# EasyEDA Pro project ProPrj_cheap-board-max-10_2026-05-07.epro, schematic Schematic1

## Sheets
1 PWR: Board Name: Board1; Create Date: 2026-03-08; Page Name: PWR; Project Name: cheap-board-max-10; Schematic Name: Schematic1; Update Date: 2026-04-17; Drawn: -; Page Size: A4; Reviewed: -; Version: V1.0
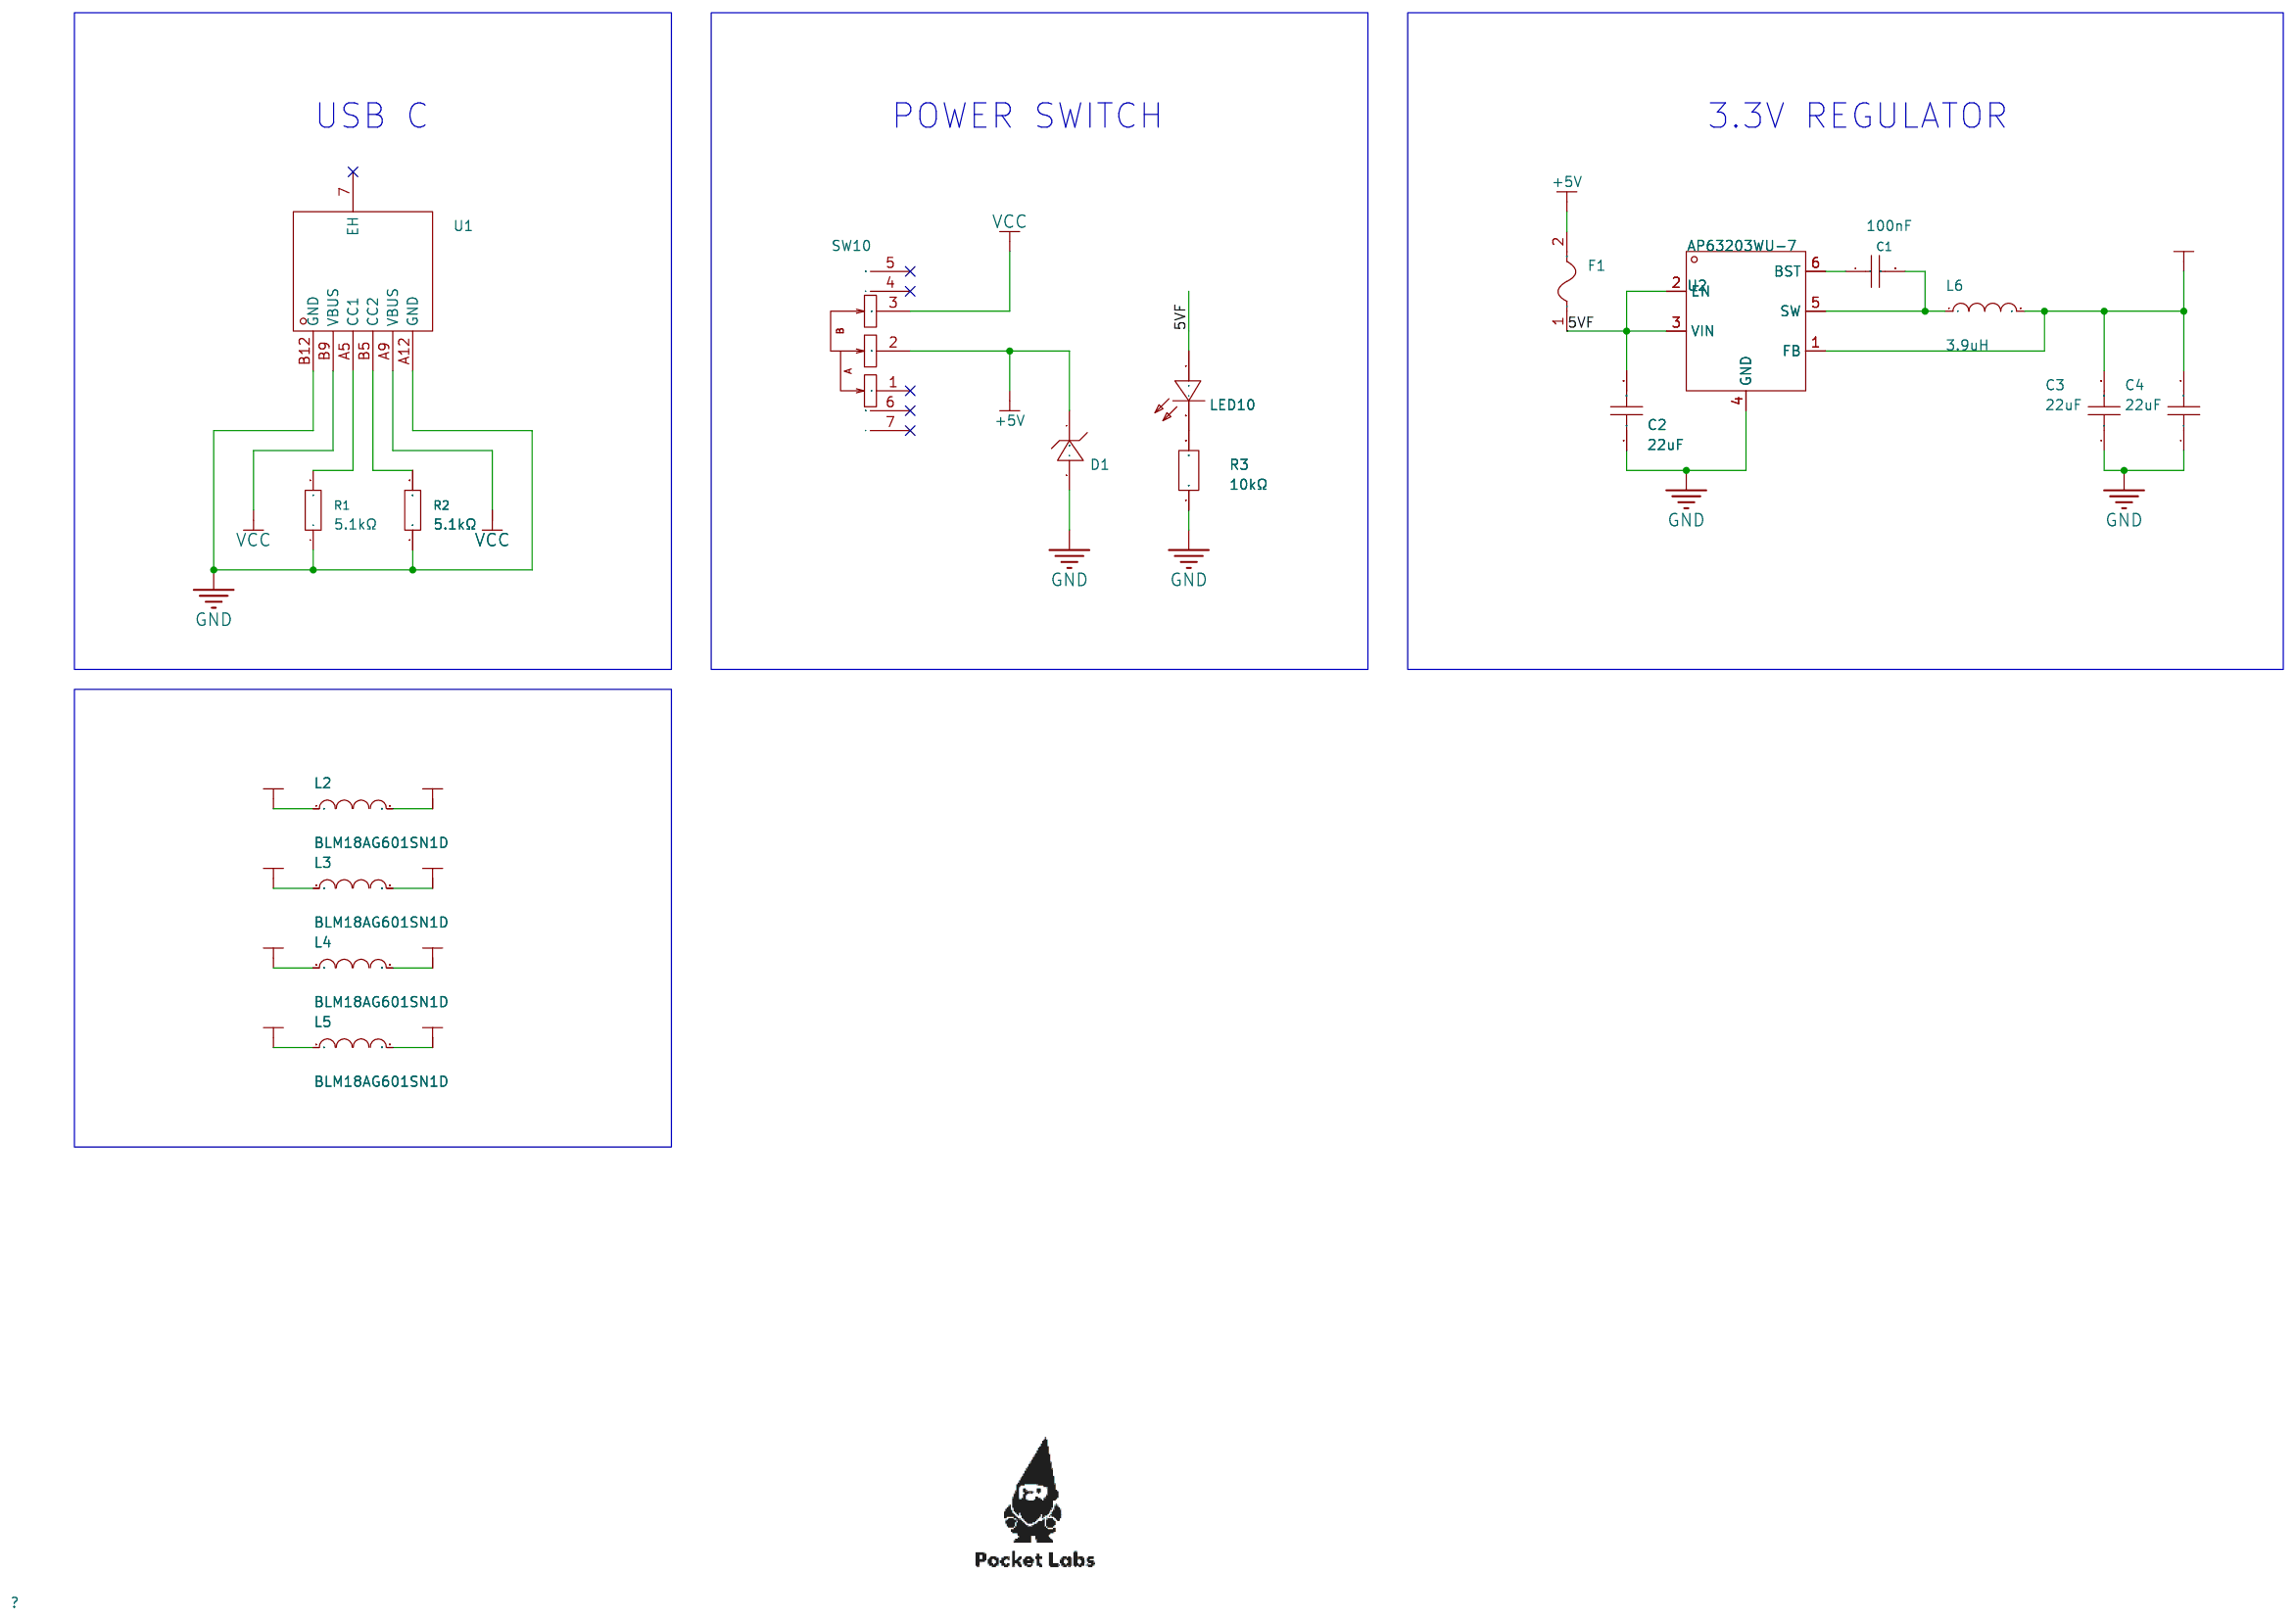
[diagram p0: PWR]
2 MAX 10: Page Name: MAX 10; Company: EasyEDA.com
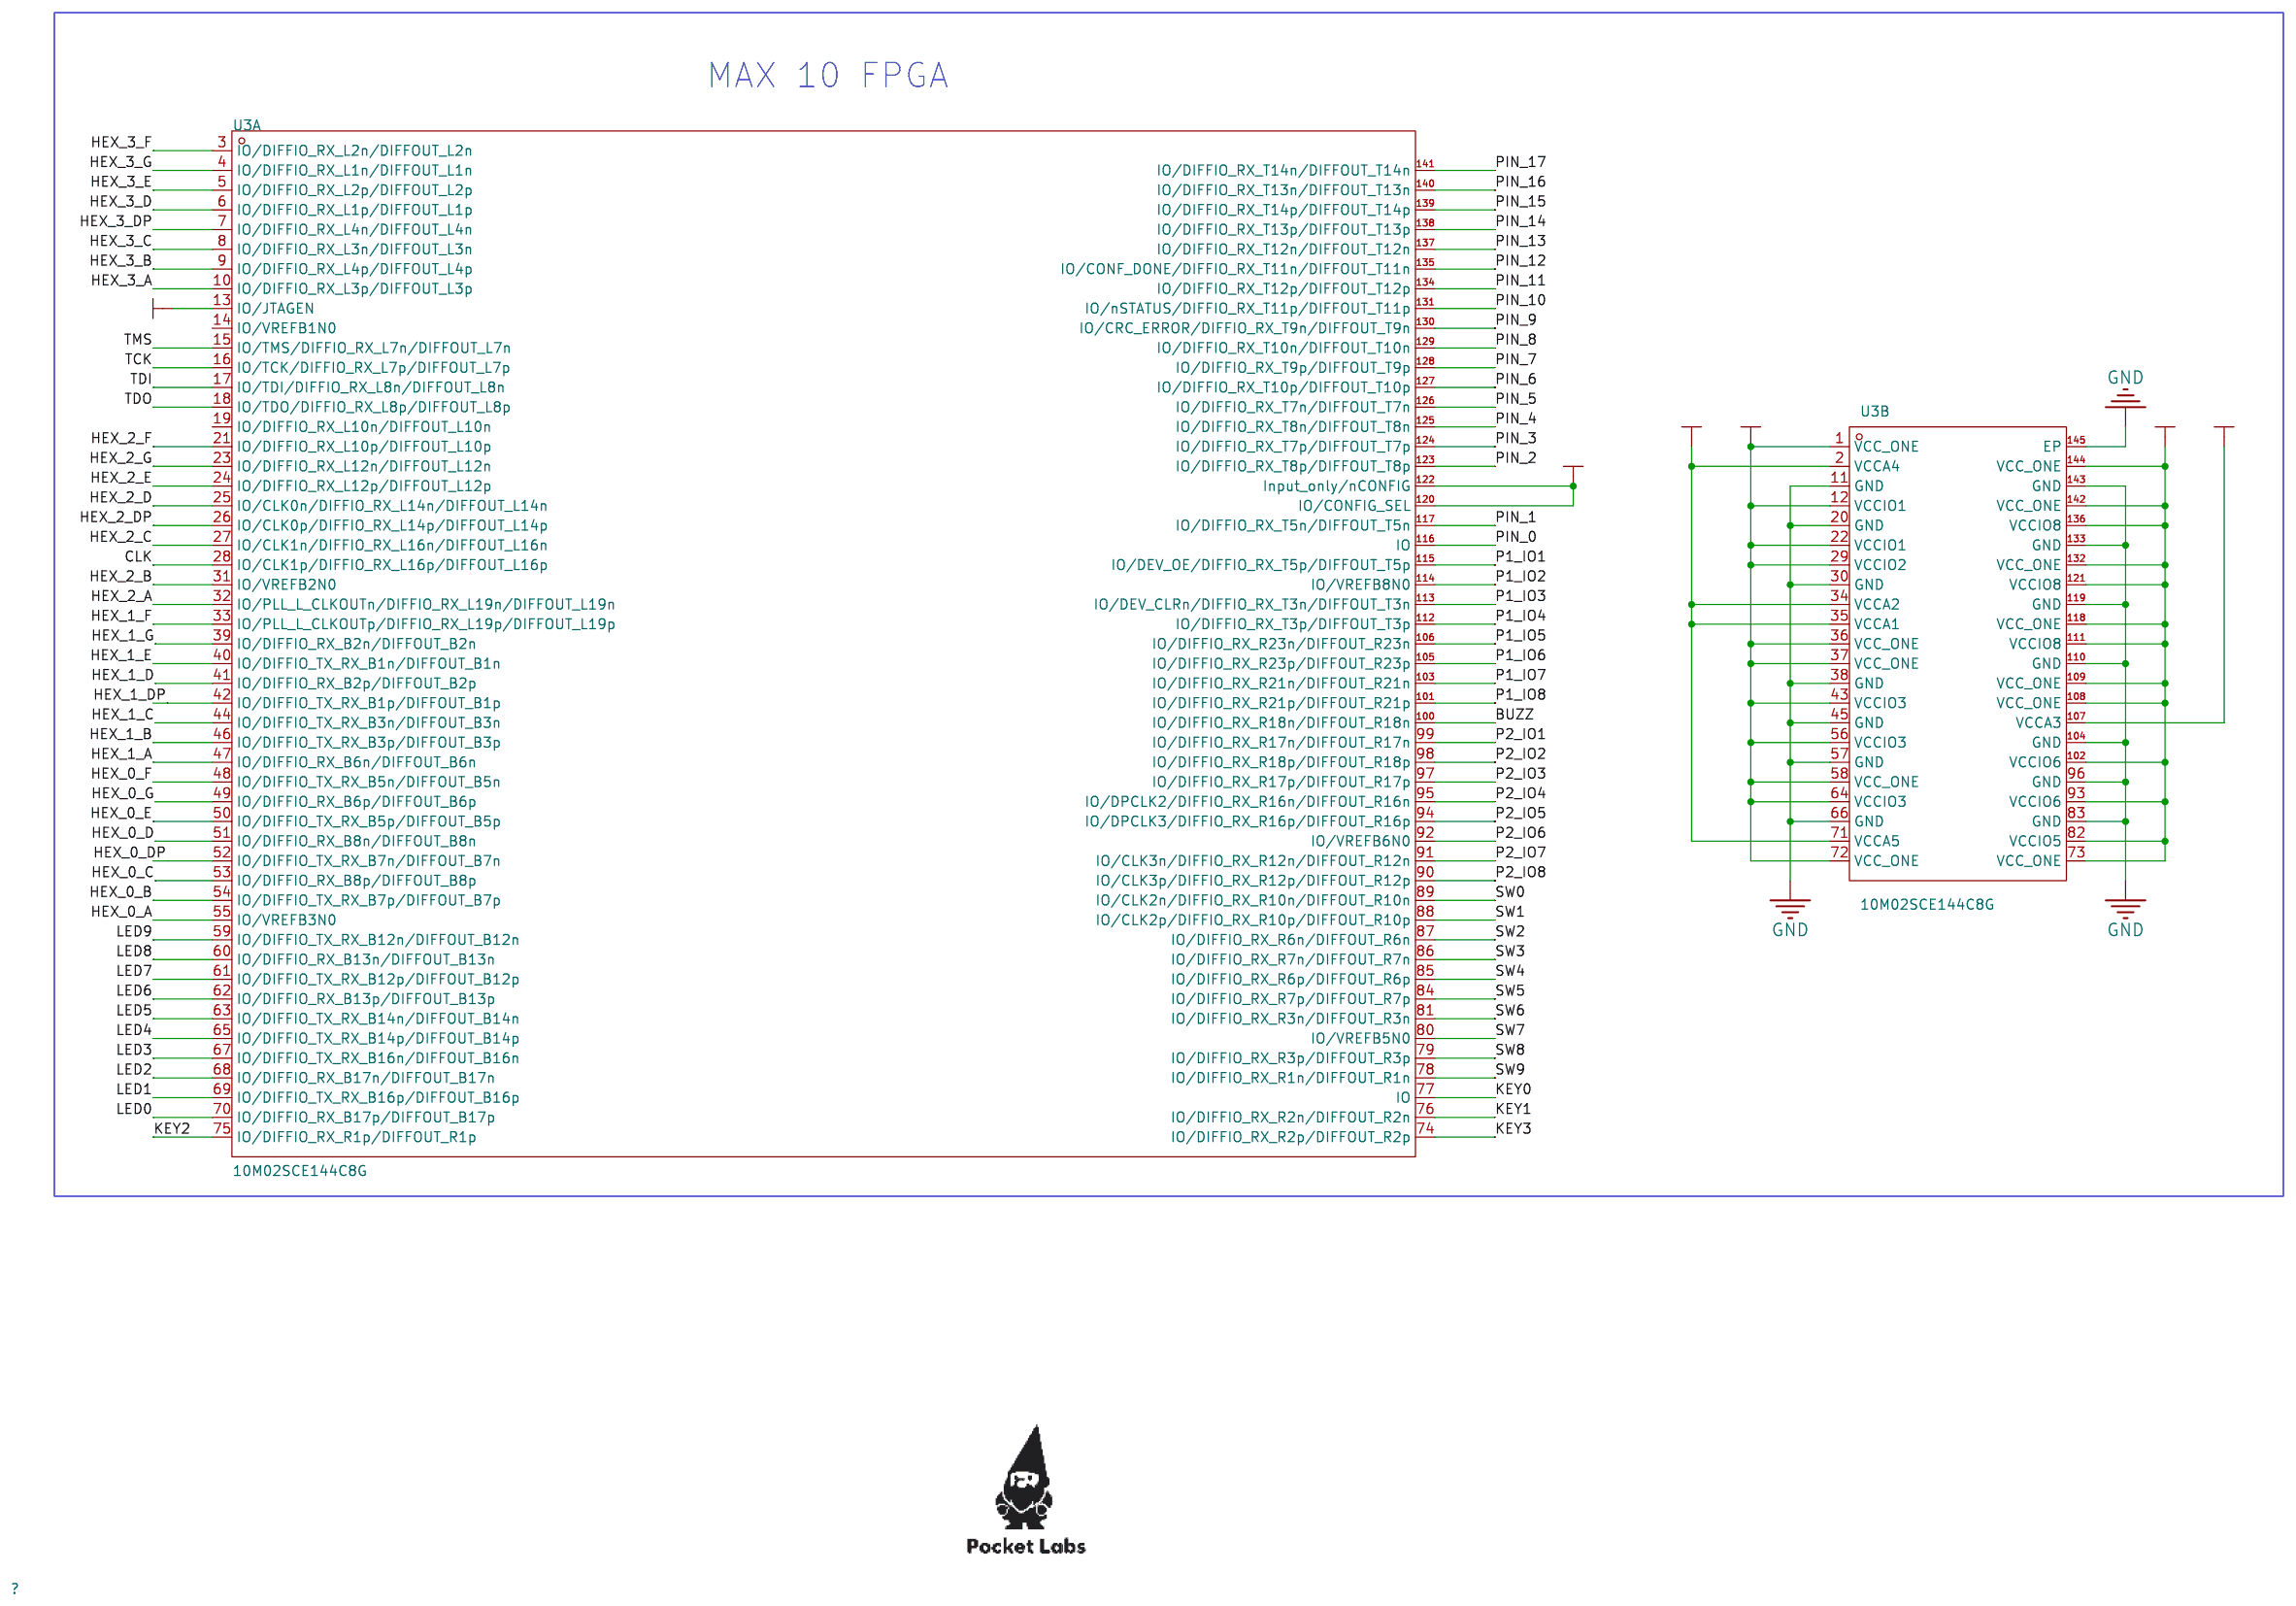
[diagram p1: MAX 10]
3 DEC: Page Name: DEC; Company: EasyEDA.com
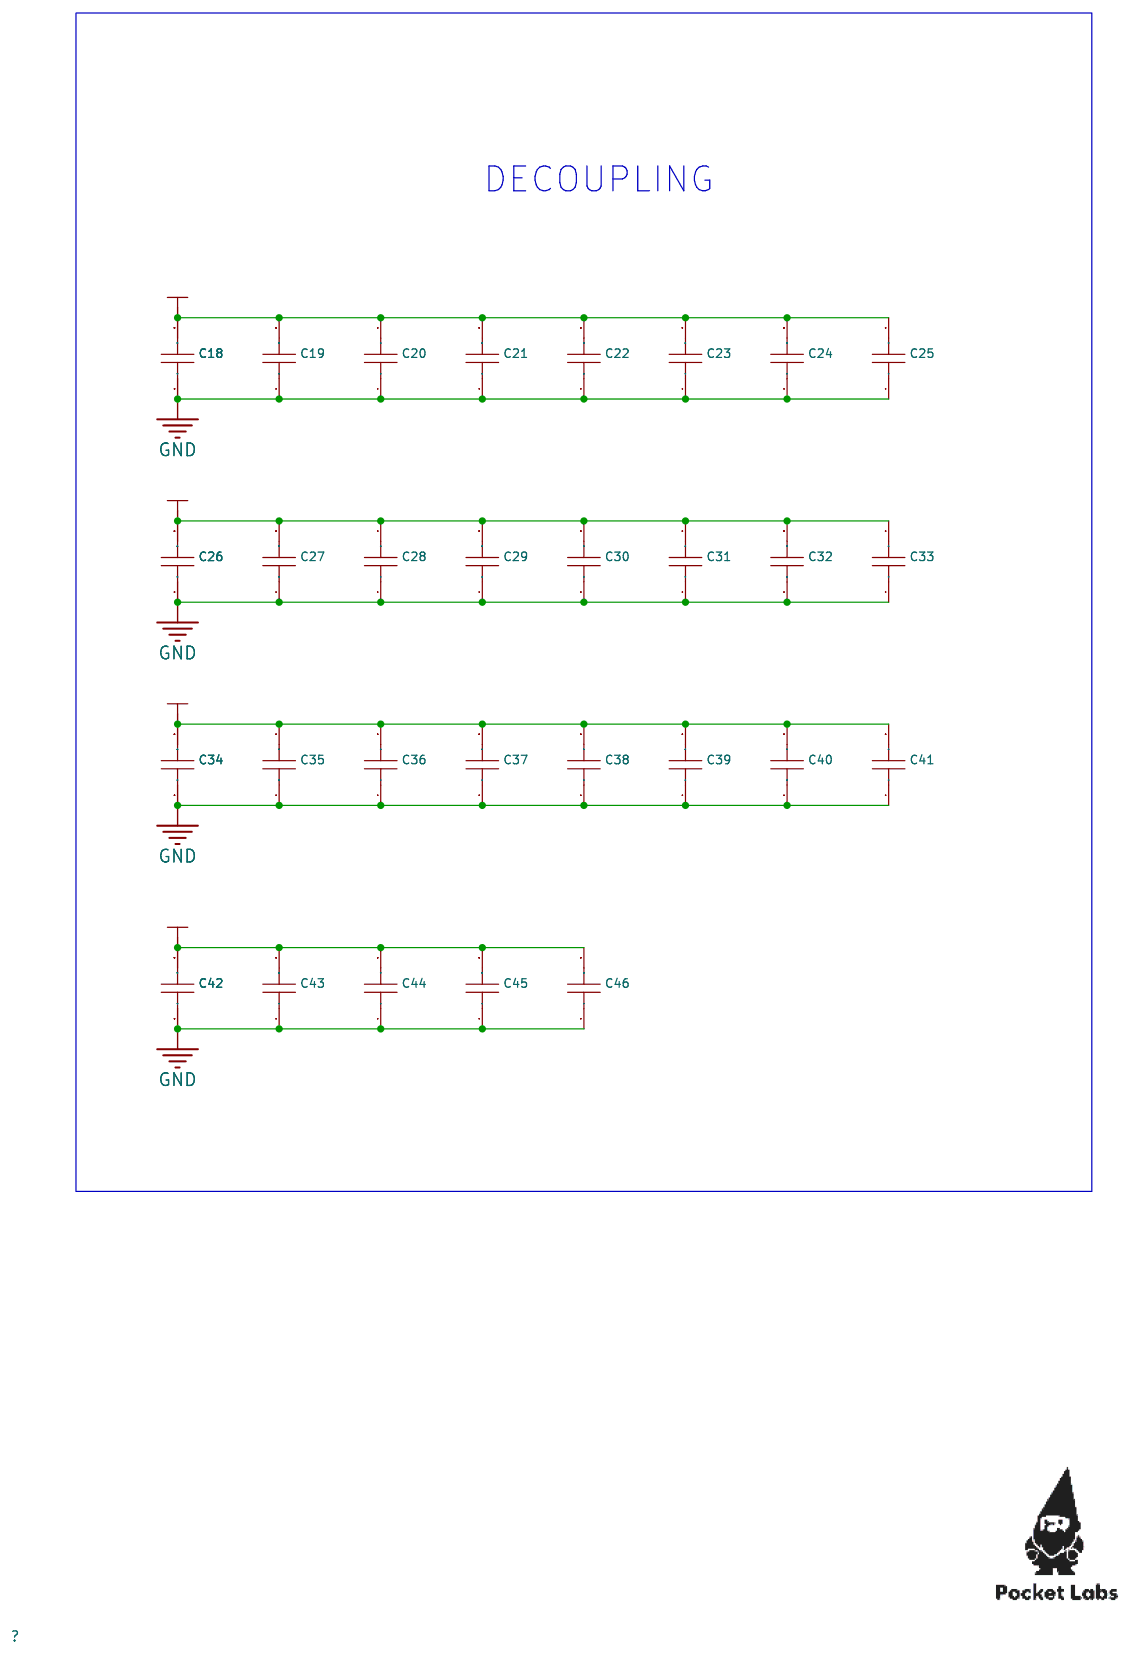
[diagram p2: DEC]
4 PERIPHERALS: Page Name: PERIPHERALS; Update Date: 2026-03-10; Company: EasyEDA.com
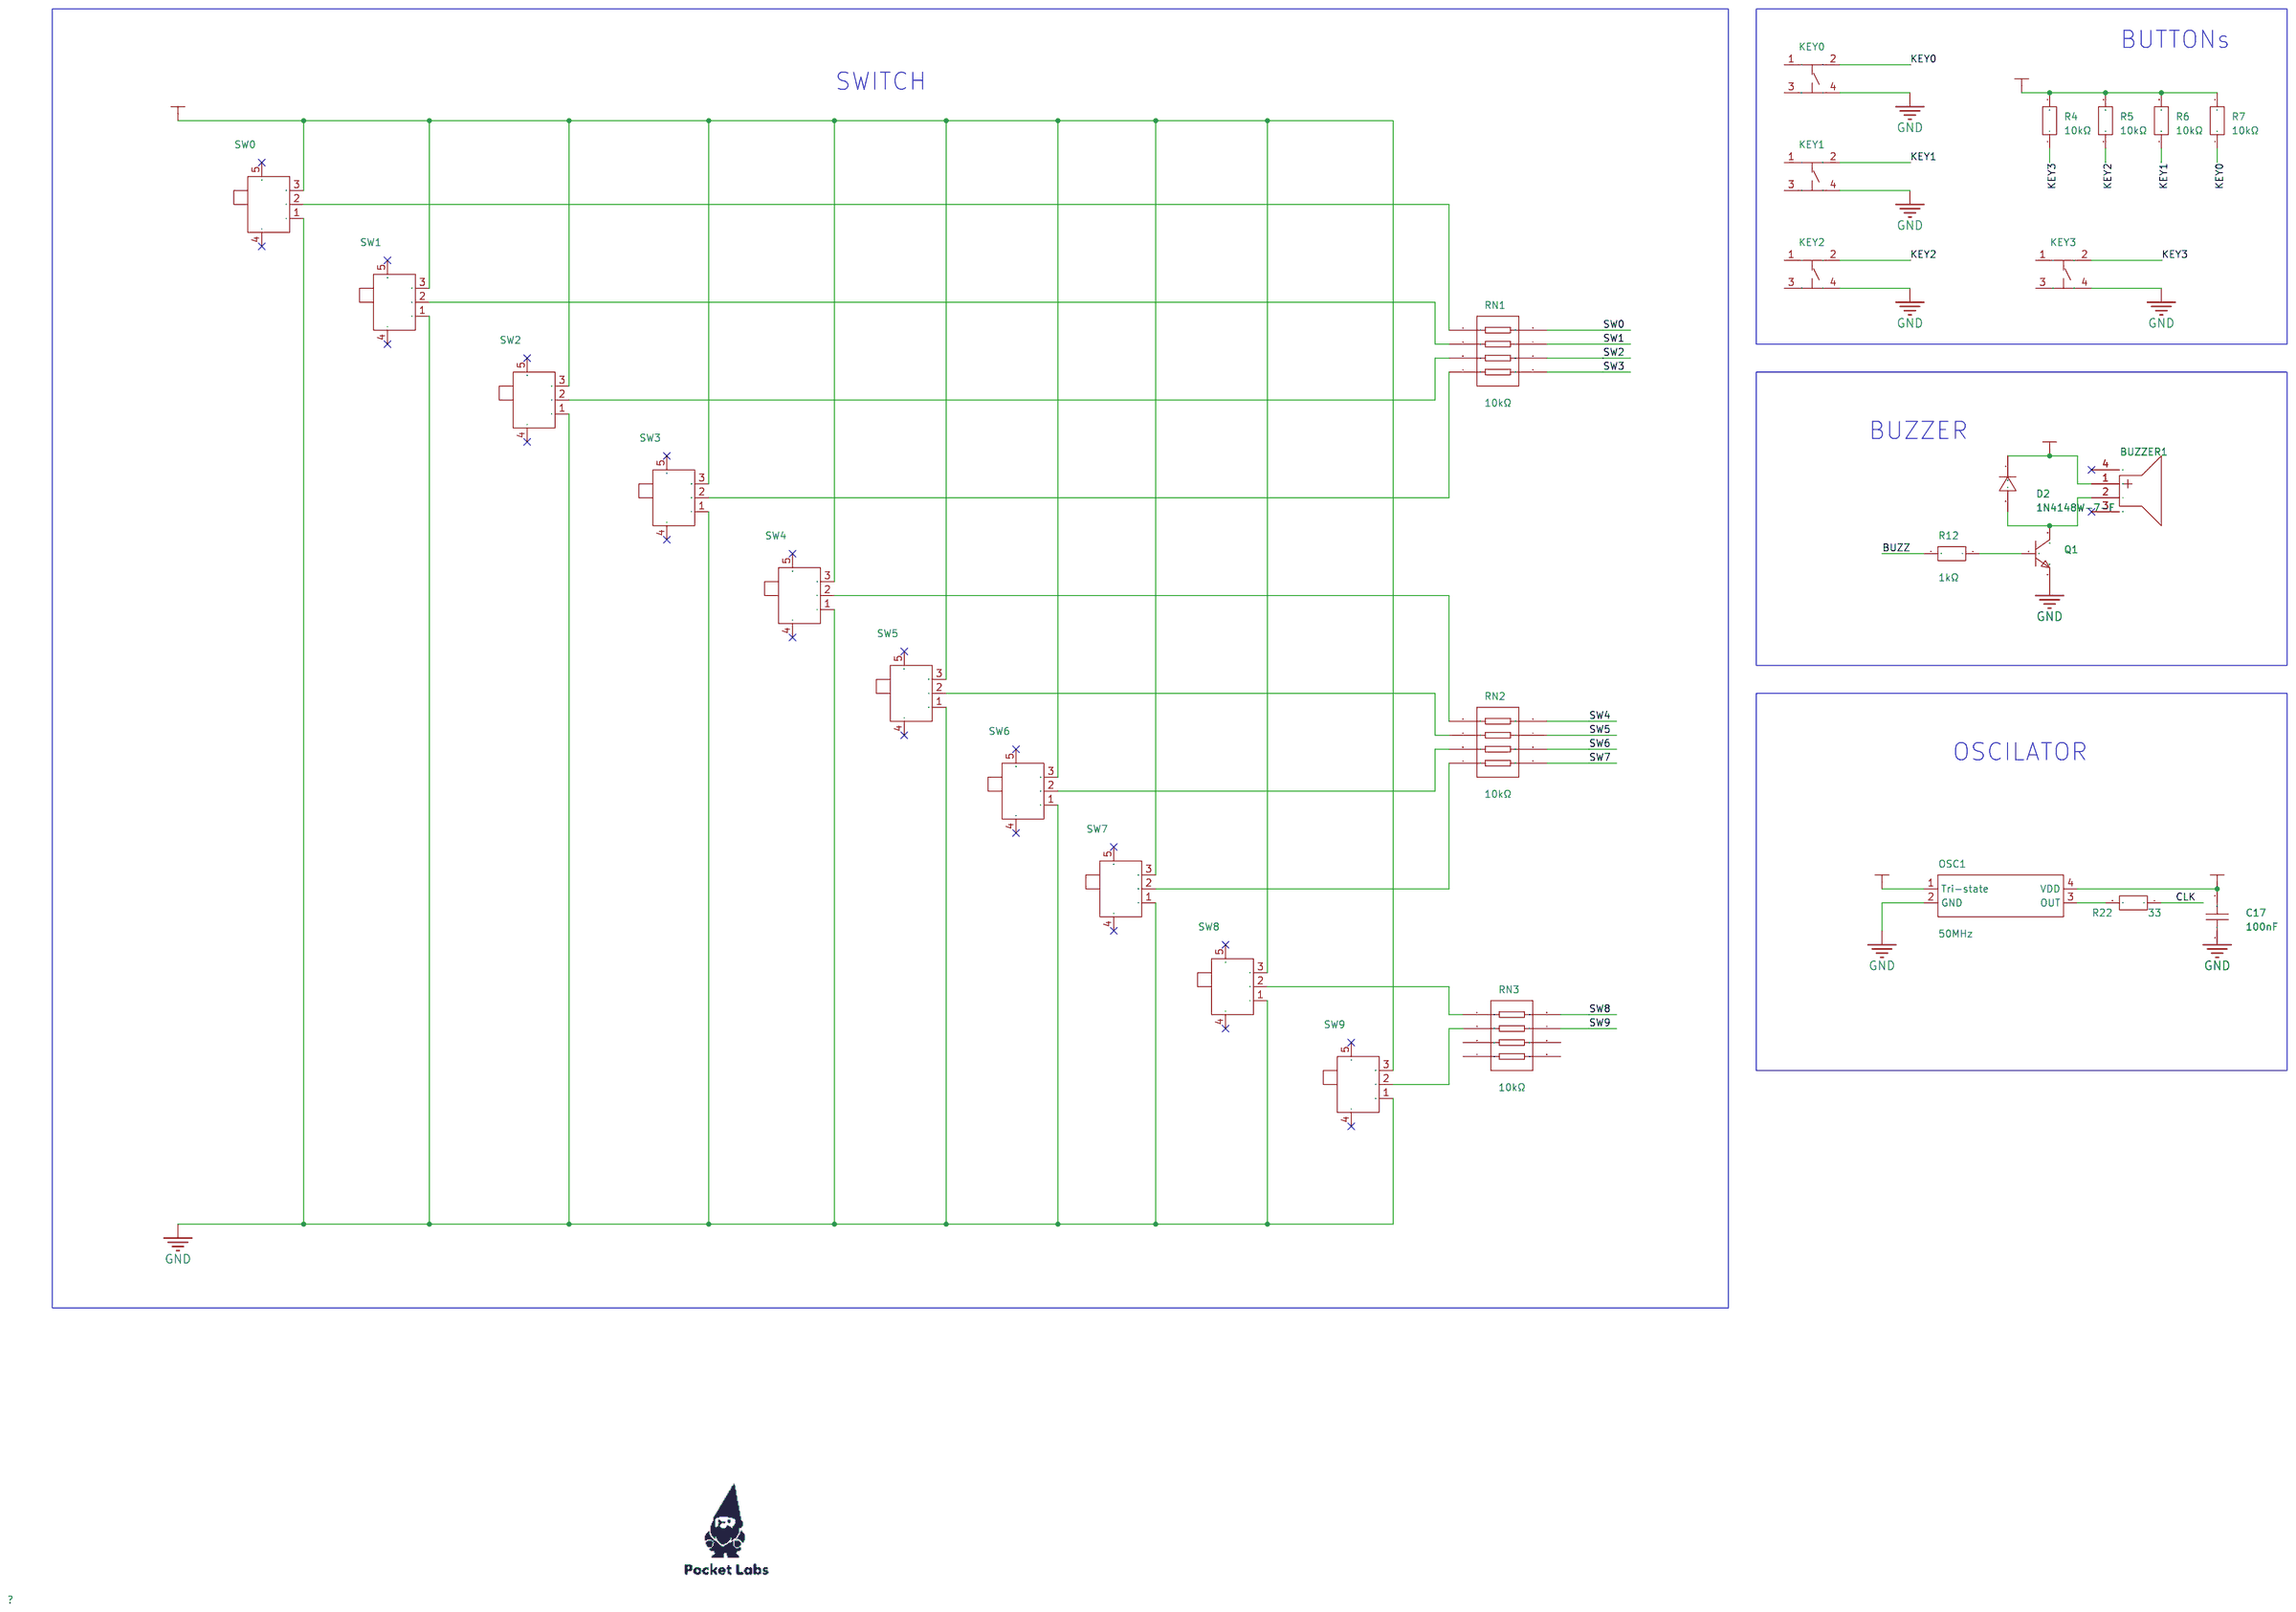
[diagram p3: PERIPHERALS]
5 LEDs: Page Name: LEDs; Company: EasyEDA.com
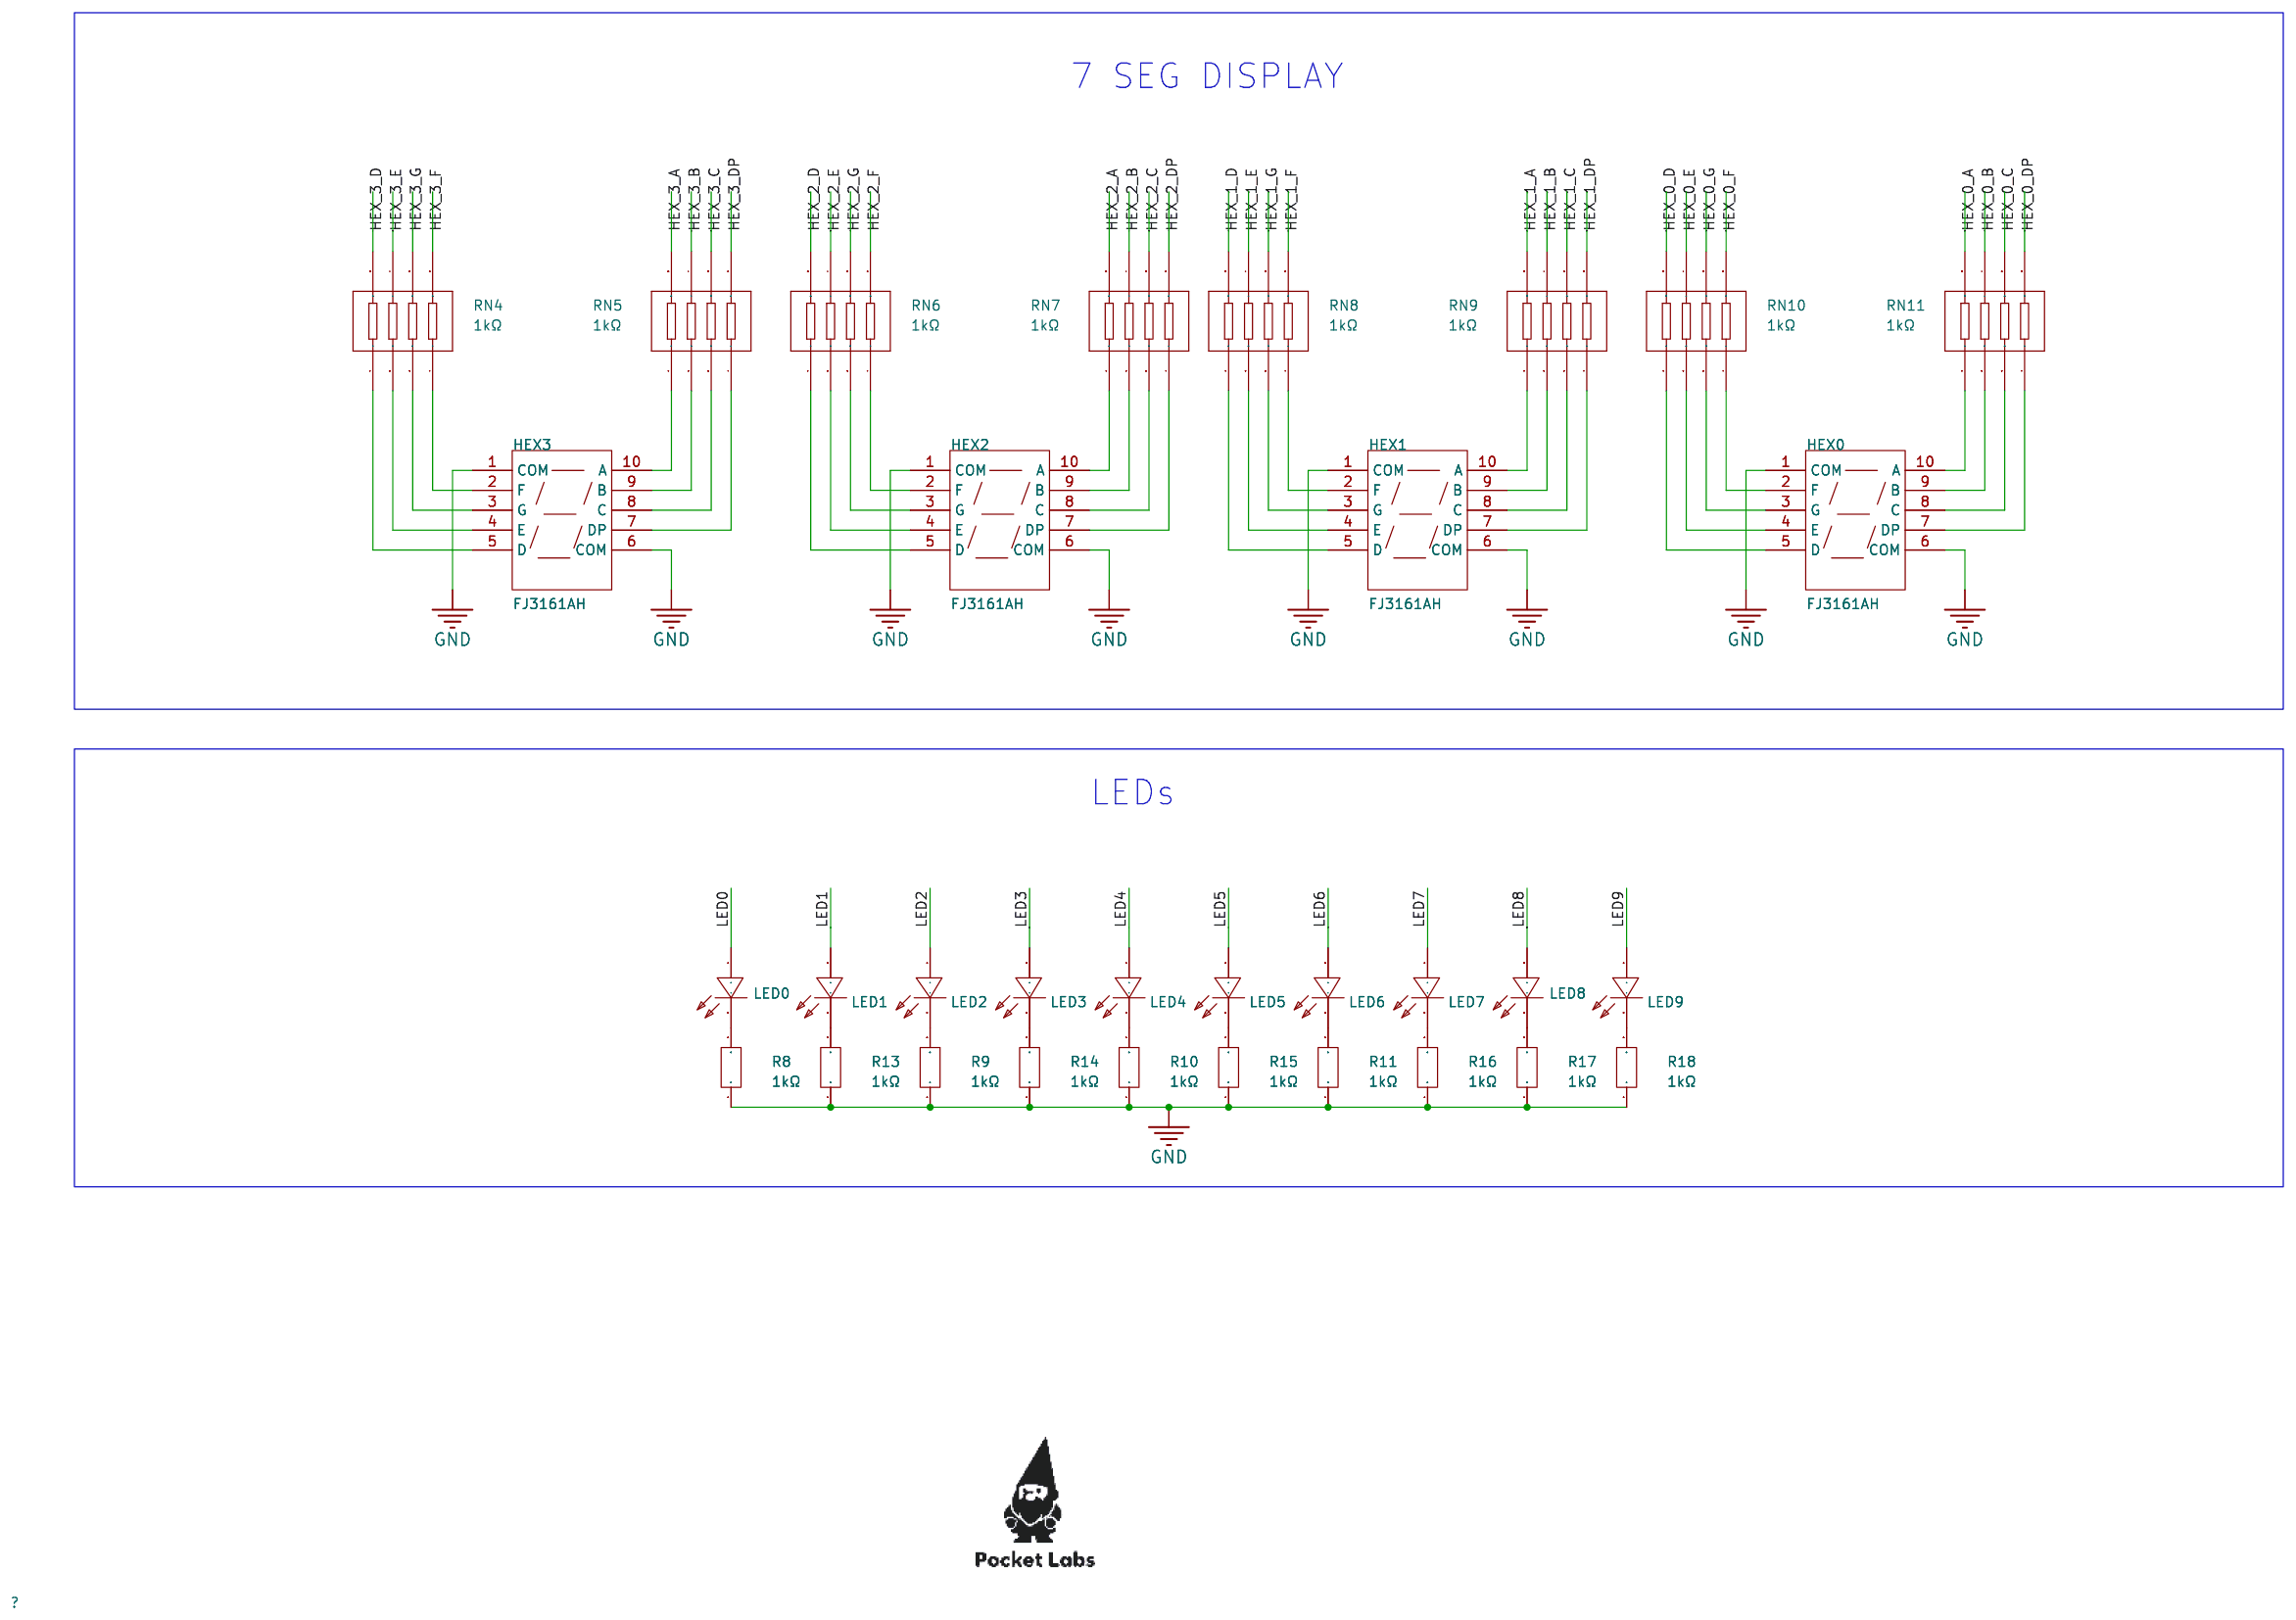
[diagram p4: LEDs]
6 CONN: Page Name: CONN; Company: EasyEDA.com
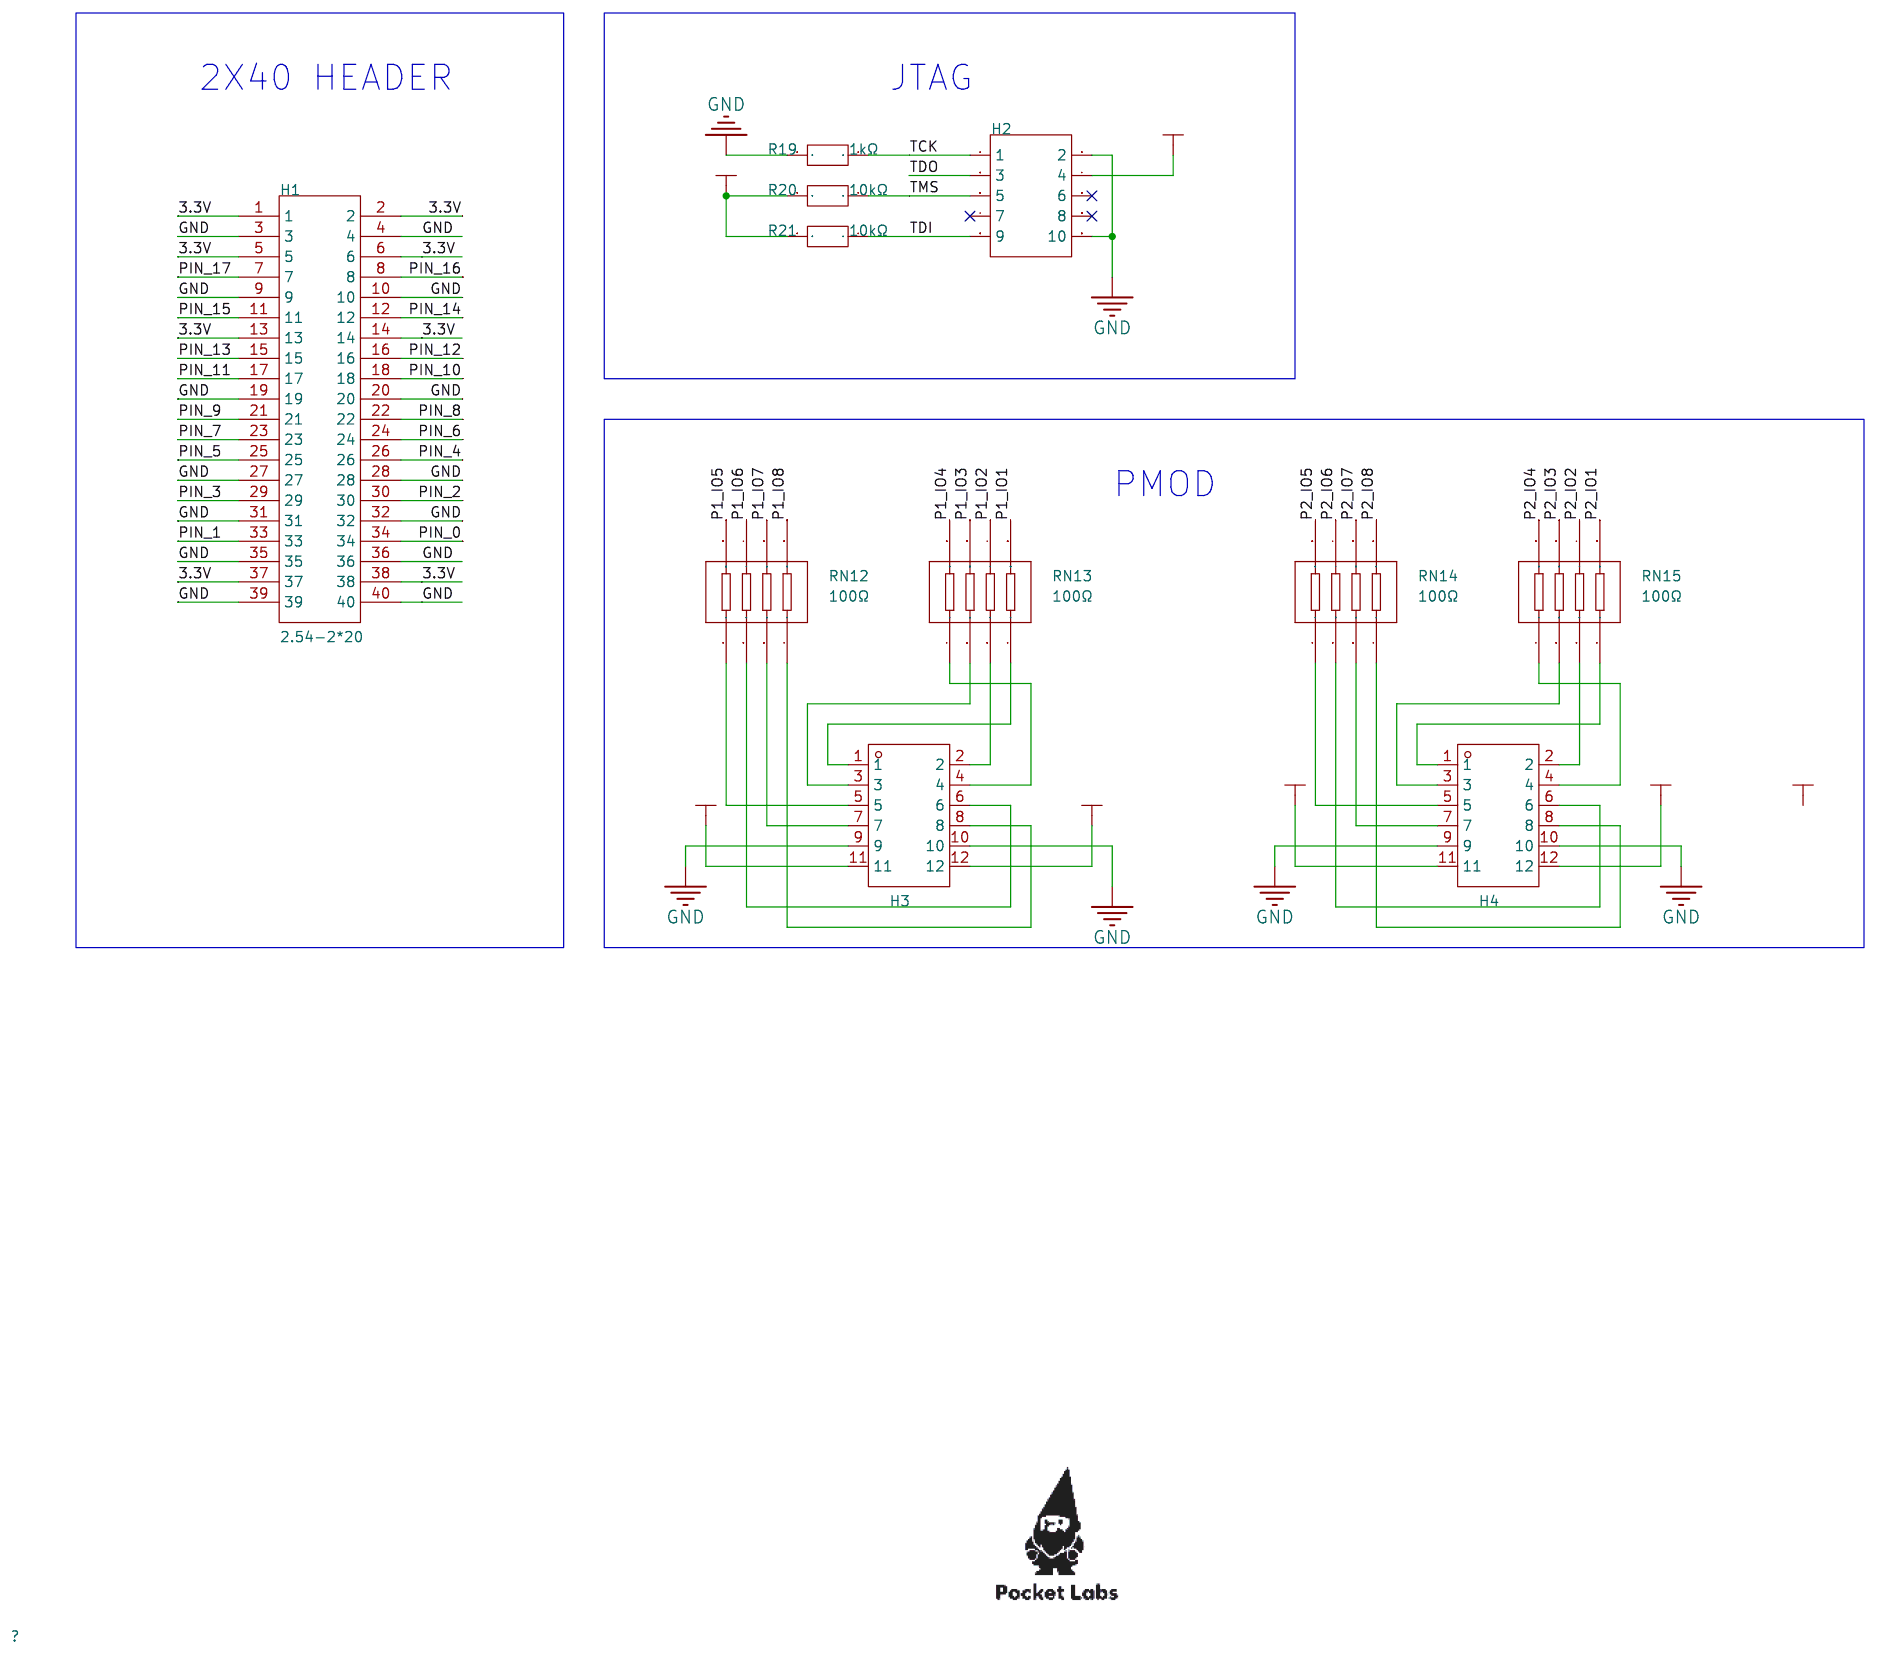
[diagram p5: CONN]

## Parts
sheet CONN
H1  2.54-2*20  [HDR-TH_40P-P2.54-V-F-R2-C20-S2.54]
H2  2.54-2*5P简牛  [IDC-TH_10P-P2.54_C5665]
H3  HX PM2.54-2x6P WC  [HDR-TH_12P-P2.54-H-F-R2-C6-S2.54-W12.7-N]
H4  HX PM2.54-2x6P WC  [HDR-TH_12P-P2.54-H-F-R2-C6-S2.54-W12.7-N]
R19  1kΩ  [R0603]
R20  10kΩ  [R0603]
R21  10kΩ  [R0603]
RN12  100Ω  [RES-ARRAY-SMD_0603-8P-L3.2-W1.6-BL]
RN13  100Ω  [RES-ARRAY-SMD_0603-8P-L3.2-W1.6-BL]
RN14  100Ω  [RES-ARRAY-SMD_0603-8P-L3.2-W1.6-BL]
RN15  100Ω  [RES-ARRAY-SMD_0603-8P-L3.2-W1.6-BL]
sheet DEC
C18  100nF  [C0402]
C19  100nF  [C0402]
C20  100nF  [C0402]
C21  100nF  [C0402]
C22  100nF  [C0402]
C23  100nF  [C0402]
C24  100nF  [C0402]
C25  100nF  [C0402]
C26  100nF  [C0402]
C27  100nF  [C0402]
C28  100nF  [C0402]
C29  100nF  [C0402]
C30  100nF  [C0402]
C31  100nF  [C0402]
C32  100nF  [C0402]
C33  100nF  [C0402]
C34  100nF  [C0402]
C35  100nF  [C0402]
C36  100nF  [C0402]
C37  100nF  [C0402]
C38  100nF  [C0402]
C39  100nF  [C0402]
C40  100nF  [C0402]
C41  100nF  [C0402]
C42  100nF  [C0402]
C43  100nF  [C0402]
C44  100nF  [C0402]
C45  100nF  [C0402]
C46  100nF  [C0402]
sheet LEDs
HEX0  FJ3161AH  [LED-SEG-TH_10P-L14.0-W7.5-P2.54-S5.08-TL]
HEX1  FJ3161AH  [LED-SEG-TH_10P-L14.0-W7.5-P2.54-S5.08-TL]
HEX2  FJ3161AH  [LED-SEG-TH_10P-L14.0-W7.5-P2.54-S5.08-TL]
HEX3  FJ3161AH  [LED-SEG-TH_10P-L14.0-W7.5-P2.54-S5.08-TL]
LED0  YLED0603R  [LED0603-FD]
LED1  YLED0603R  [LED0603-FD]
LED2  YLED0603R  [LED0603-FD]
LED3  YLED0603R  [LED0603-FD]
LED4  YLED0603R  [LED0603-FD]
LED5  YLED0603R  [LED0603-FD]
LED6  YLED0603R  [LED0603-FD]
LED7  YLED0603R  [LED0603-FD]
LED8  YLED0603R  [LED0603-FD]
LED9  YLED0603R  [LED0603-FD]
R8  1kΩ  [R0603]
R9  1kΩ  [R0603]
R10  1kΩ  [R0603]
R11  1kΩ  [R0603]
R13  1kΩ  [R0603]
R14  1kΩ  [R0603]
R15  1kΩ  [R0603]
R16  1kΩ  [R0603]
R17  1kΩ  [R0603]
R18  1kΩ  [R0603]
RN4  1kΩ  [RES-ARRAY-SMD_0603-8P-L3.2-W1.6-BL]
RN5  1kΩ  [RES-ARRAY-SMD_0603-8P-L3.2-W1.6-BL]
RN6  1kΩ  [RES-ARRAY-SMD_0603-8P-L3.2-W1.6-BL]
RN7  1kΩ  [RES-ARRAY-SMD_0603-8P-L3.2-W1.6-BL]
RN8  1kΩ  [RES-ARRAY-SMD_0603-8P-L3.2-W1.6-BL]
RN9  1kΩ  [RES-ARRAY-SMD_0603-8P-L3.2-W1.6-BL]
RN10  1kΩ  [RES-ARRAY-SMD_0603-8P-L3.2-W1.6-BL]
RN11  1kΩ  [RES-ARRAY-SMD_0603-8P-L3.2-W1.6-BL]
sheet MAX 10
U3  10M02SCE144C8G  [EQFP-144_L20.0-W20.0-P0.50-LS22.0-BL-EP4.0]  (sections 1,2)
sheet PERIPHERALS
BUZZER1  2.7kHz  [BUZ-SMD_4P-L7.5-W7.5-P7.59-TL]
C17  100nF  [C0603]
D2  1N4148W-7-F  [SOD-123_L2.7-W1.6-LS3.7-RD-1]
KEY0  KH-6X6X6H-STM  [SW-SMD_4P-L6.0-W6.0-P4.50-LS9.0_KH-6X6X6H-STM]
KEY1  KH-6X6X6H-STM  [SW-SMD_4P-L6.0-W6.0-P4.50-LS9.0_KH-6X6X6H-STM]
KEY2  KH-6X6X6H-STM  [SW-SMD_4P-L6.0-W6.0-P4.50-LS9.0_KH-6X6X6H-STM]
KEY3  KH-6X6X6H-STM  [SW-SMD_4P-L6.0-W6.0-P4.50-LS9.0_KH-6X6X6H-STM]
OSC1  50MHz  [OSC-SMD_4P-L3.2-W2.5-BL]
Q1  MMBT3904LT1G  [SOT-23-3_L2.9-W1.6-P1.90-LS2.8-BR]
R4  10kΩ  [R0603]
R5  10kΩ  [R0603]
R6  10kΩ  [R0603]
R7  10kΩ  [R0603]
R12  1kΩ  [R0603]
R22  33  [R0603]
RN1  10kΩ  [RES-ARRAY-SMD_0603-8P-L3.2-W1.6-BL]
RN2  10kΩ  [RES-ARRAY-SMD_0603-8P-L3.2-W1.6-BL]
RN3  10kΩ  [RES-ARRAY-SMD_0603-8P-L3.2-W1.6-BL]
SW0  SS12F44G4  [SW-TH_SHOU-HAN_SS12F44G4]
SW1  SS12F44G4  [SW-TH_SHOU-HAN_SS12F44G4]
SW2  SS12F44G4  [SW-TH_SHOU-HAN_SS12F44G4]
SW3  SS12F44G4  [SW-TH_SHOU-HAN_SS12F44G4]
SW4  SS12F44G4  [SW-TH_SHOU-HAN_SS12F44G4]
SW5  SS12F44G4  [SW-TH_SHOU-HAN_SS12F44G4]
SW6  SS12F44G4  [SW-TH_SHOU-HAN_SS12F44G4]
SW7  SS12F44G4  [SW-TH_SHOU-HAN_SS12F44G4]
SW8  SS12F44G4  [SW-TH_SHOU-HAN_SS12F44G4]
SW9  SS12F44G4  [SW-TH_SHOU-HAN_SS12F44G4]
sheet PWR
C1  100nF  [C0603]
C2  22uF  [C1206]
C3  22uF  [C1206]
C4  22uF  [C1206]
D1  SMF5.0A  [SOD-123FL_L2.7-W1.8-LS3.8-RD]
F1  MF-MSMF050-2  [F1812]
L2  BLM18AG601SN1D  [L0603]
L3  BLM18AG601SN1D  [L0603]
L4  BLM18AG601SN1D  [L0603]
L5  BLM18AG601SN1D  [L0603]
L6  3.9uH  [IND-SMD_TNR4030S-3R9MTF]
LED10  YLED0603R  [LED0603-FD]
R1  5.1kΩ  [R0603]
R2  5.1kΩ  [R0603]
R3  10kΩ  [R0603]
SW10  MK-12C02-G020  [SW-SMD_MK-12C02-G020]
U1  USB-TYPE-C-009  [TYPE-C-SMD_TYPE-C-6P]
U2  AP63203WU-7  [TSOT-26_L2.9-W1.6-P0.95-LS2.8-BL]

## Library data of the parts
H1 = 2.54-2*20: Holes Structure:2x20P Pitch:2.54mm Row Spacing:2.54mm Circular Hole / Square Hole:Square Hole Mounting Type:Through Hole Number of Rows:2 Number of Positions:40P Current Rating:2.5A Voltage Rating (Max):- Holes Direction:Top Insulation Height:8.5mm Operat; LCSC Part Name: 间距:2.54mm 2x20P 直插; Supplier Part: C2977589; Manufacturer: ZHOURI(洲日); Supplier Footprint: 插件,P=2.54mm; JLCPCB Part Class: Extended Part; Datasheet: https://item.szlcsc.com/datasheet/2.54-2*20/3388941.html; Supplier: LCSC; Holes Structure: 2x20P; Pitch: 2.54mm; Row Spacing: 2.54mm; Circular Hole / Square Hole: Square Hole; Mounting Type: Through Hole; Number of Rows: 2; Number of Positions: 40P; Current Rating: 2.5A; Holes Direction: Top; Insulation Height: 8.5mm; Operating Temperature: -40℃~+105℃
H2 = 2.54-2*5P简牛: Connector Type:IDC Header Pitch:2.54mm Number of Positions or Pins:2x5P Current Rating:1A Holder Type:Through Hole Row Spacing:2.54mm Number of Rows:2 Number of PINs Per Row:5 Contact Material:Brass Contact Plating:Gold Operating Temperature:-55℃~+105℃ Op; LCSC Part Name: 2.54mm 2x5P 排数:2 每排P数:5; Supplier Part: C5665; Manufacturer: BOOMELE(博穆精密); Supplier Footprint: 插件,P=2.54mm; JLCPCB Part Class: Extended Part; Datasheet: https://item.szlcsc.com/datasheet/2.54-2*5P%25E7%25AE%2580%25E7%2589%259B/6118.html; Supplier: LCSC; Connector Type: IDC Header; Pitch: 2.54mm; Number of Positions or Pins: 2x5P; Current Rating: 1A; Holder Type: Through Hole; Row Spacing: 2.54mm; Number of Rows: 2; Number of PINs Per Row: 5; Contact Material: Brass; Contact Plating: Gold; Operating Temperature: -55℃~+105℃; Color: Black
H3 H4 = HX PM2.54-2x6P WC: Holes Structure:2x6P Pitch:2.54mm Row Spacing:2.54mm Circular Hole / Square Hole:Square Hole Mounting Type:Right Angle Number of Rows:2 Number of Positions:12P Current Rating:3A Voltage Rating (Max):1kV Holes Direction:Side Insulation Height:8.5mm Contact; LCSC Part Name: 2x6P 间距:2.54mm 弯插; Supplier Part: C41417336; Manufacturer: hanxia(韩下); Supplier Footprint: 弯插,P=2.54mm; Datasheet: https://item.szlcsc.com/datasheet/HX%2520PM2.54-2x6P%2520WC/43243340.html; Supplier: LCSC; Holes Structure: 2x6P; Pitch: 2.54mm; Row Spacing: 2.54mm; Circular Hole / Square Hole: Square Hole; Mounting Type: Right Angle; Number of Rows: 2; Number of Positions: 12P; Current Rating: 3A; Voltage Rating (Max): 1kV; Holes Direction: Side; Insulation Height: 8.5mm; Contact Material: Brass; Contact Plating: Gold; Operating Temperature: -40℃~+105℃; PIN Length: 3.2mm
R3-R22 = RC0603FR-071KL: Type:Thick Film Resistor Resistance:1kΩ Tolerance:±1% Tolerance:±1% Power(Watts):100mW Voltage-Supply(Max):75V Temperature Coefficient:±100ppm/℃ Temperature Coefficient:±100ppm/℃ Operating Temperature:-55℃~+155℃ Operating Temperature:-55℃~+155℃; LCSC Part Name: 厚膜电阻 1kΩ ±1% 100mW; Supplier Part: C22548; Manufacturer: YAGEO(国巨); Supplier Footprint: 0603; JLCPCB Part Class: Extended Part; Datasheet: https://item.szlcsc.com/datasheet/RC0603FR-071KL/23274.html; Supplier: LCSC; Type: Thick Film Resistor; Tolerance: ±1%; Power(Watts): 100mW; Voltage-Supply(Max): 75V; Temperature Coefficient: ±100ppm/℃; Operating Temperature: -55℃~+155℃
RN12-RN15 = YC164-FR-07100RL: Number of Resistors: Resistance:100Ω Tolerance:±1% Tolerance:±1% Power(Watts):62.5mW Temperature Coefficient:±200ppm/℃ Temperature Coefficient:±200ppm/℃ Number of Pins:; LCSC Part Name: 100Ω ±1%; Supplier Part: C136838; Manufacturer: YAGEO(国巨); Supplier Footprint: 0603x4; JLCPCB Part Class: Extended Part; Datasheet: https://item.szlcsc.com/datasheet/YC164-FR-07100RL/148154.html; Supplier: LCSC; Tolerance: ±1%; Power(Watts): 62.5mW; Temperature Coefficient: ±200ppm/℃
C18-C46 = CC0402KRX7R7BB104: Capacitance: Tolerance:±10% Tolerance:±10% Voltage Rated: Temperature Coefficient:; Supplier: LCSC; Manufacturer: YAGEO(国巨); Supplier Part: C60474; JLCPCB Part Class: Extended Part; LCSC Part Name: 100nF ±10% 16V; Supplier Footprint: 0402; Datasheet: https://atta.szlcsc.com/upload/public/pdf/source/20211223/9278FD768280B81DDBEF48FA36411A03.pdf; Tolerance: ±10%
HEX0-HEX3 = FJ3161AH: Digit/Alpha Size(inch):0.36 Illumination Color:Red LED Polarity:Common Cathode; LCSC Part Name: 0.36英寸红色数码管 共阴极; Supplier Part: C10684; Manufacturer: 志浩; Supplier Footprint: 插件; JLCPCB Part Class: Extended Part; Datasheet: https://item.szlcsc.com/datasheet/FJ3161AH/11228.html; Supplier: LCSC; Digit/Alpha Size(inch): 0.36; Illumination Color: Red; LED Polarity: Common Cathode
LED0-LED10 = YLED0603R: Lamp Holder Type:-；- Illumination Color:Red Voltage - Forward(Vf):1.8V~2.4V Voltage - Forward(Vf):1.8V~2.4V Power(Watts):- Forward Current:25mA Wavelength - Dominant:620nm~625nm Wavelength - Dominant:620nm~625nm Peak Wavelength:- Diode Configuration:Discr; LCSC Part Name: 红色 独立二极管; Supplier Part: C19171390; Manufacturer: YONGYUTAI(永裕泰); Supplier Footprint: 0603; JLCPCB Part Class: Extended Part; Datasheet: https://item.szlcsc.com/datasheet/YLED0603R/20382441.html; Supplier: LCSC; Lamp Holder Type: -；-; Illumination Color: Red; Voltage - Forward(Vf): 1.8V~2.4V; Forward Current: 25mA; Wavelength - Dominant: 620nm~625nm; Diode Configuration: Discrete Diode; Luminous Intensity: 120mcd; Viewing Angle: 120°; Operating Temperature: -40℃~+85℃
RN4-RN11 = 4D03WGJ0102T5E: Number of Resistors: Resistance:1kΩ Tolerance:±5% Tolerance:±5% Power(Watts): Temperature Coefficient:±200ppm/℃ Temperature Coefficient:±200ppm/℃ Number of Pins:; LCSC Part Name: 1kΩ ±5%; Supplier Part: C20197; Manufacturer: UNI-ROYAL(厚声); Supplier Footprint: 0603x4; JLCPCB Part Class: Basic Part; Datasheet: https://atta.szlcsc.com/upload/public/pdf/source/20191224/C474318_2527498AE30E813171187CCD28401A71.pdf; Supplier: LCSC; Tolerance: ±5%; Temperature Coefficient: ±200ppm/℃
U3 = 10M02SCE144C8G: Logic Elements / Cells:2000 Logic Array Blocks:125 Embedded Block RAM:110592bit Operating Temperature Range:0℃~+85℃ Operating Temperature Range:0℃~+85℃; Supplier Part: C78764; Manufacturer: Intel/Altera; Supplier Footprint: EQFP-144(20x20); JLCPCB Part Class: Extended Part; Datasheet: https://atta.szlcsc.com/upload/public/pdf/source/231023/C17190331-aafe6314130726f4061c619bf16ddb11.pdf; Supplier: LCSC; Logic Elements / Cells: 2000; Logic Array Blocks: 125; Embedded Block RAM: 110592bit; Operating Temperature Range: 0℃~+85℃
BUZZER1 = MLT-7525: Driver Circuitry:Passive (Externally Driven) Technology:Electromagnetic Voltage Rating:3.6V Voltage - Supply:2.5V~4.5V Voltage - Supply:2.5V~4.5V Frequency:2.7kHz Current Consumption:95mA Sound Pressure Level(SPL):80dB Length:7.5mm Width:7.5mm Height:2.8m; LCSC Part Name: 无源(外部驱动) 电磁式 2.7kHz; Supplier Part: C95299; Manufacturer: 华能; Supplier Footprint: SMD,7.5x7.5mm; JLCPCB Part Class: Extended Part; Datasheet: https://item.szlcsc.com/datasheet/MLT-7525/96501.html; Supplier: LCSC; Driver Circuitry: Passive (Externally Driven); Technology: Electromagnetic; Voltage Rating: 3.6V; Voltage - Supply: 2.5V~4.5V; Current Consumption: 95mA; Sound Pressure Level(SPL): 80dB; Length: 7.5mm; Width: 7.5mm; Height: 2.8mm; Operating Temperature: -20℃~+70℃
C17 = CC0603KRX7R9BB104: Capacitance:100nF Tolerance:±10% Tolerance:±10% Voltage Rating:50V Temperature Coefficient:X7R; LCSC Part Name: 100nF ±10% 50V; Supplier Part: C14663; Manufacturer: YAGEO(国巨); Supplier Footprint: 0603; JLCPCB Part Class: Basic Part; Datasheet: https://atta.szlcsc.com/upload/public/pdf/source/20180910/C282072_33301C7F631E79921B82A8DAC6BCC5B3.pdf; Supplier: LCSC; Tolerance: ±10%; Voltage Rating: 50V; Temperature Coefficient: X7R
D2 = 1N4148W-7-F: Diode Configuration:Independent Voltage - Forward(Vf@If):1.25V@150mA Voltage - DC Reverse(Vr):100V Current - Rectified:300mA Pd - Power Dissipation:400mW Reverse Leakage Current (Ir):1uA@75V Reverse Recovery Time (trr):4ns Operating Junction Temperature R; LCSC Part Name: 100V 300mA; Supplier Part: C83528; Manufacturer: DIODES(美台); Supplier Footprint: SOD-123; JLCPCB Part Class: Extended Part; Datasheet: https://item.szlcsc.com/datasheet/1N4148W-7-F/84693.html; Supplier: LCSC; Diode Configuration: Independent; Voltage - Forward(Vf@If): 1.25V@150mA; Voltage - DC Reverse(Vr): 100V; Current - Rectified: 300mA; Pd - Power Dissipation: 400mW; Reverse Leakage Current (Ir): 1uA@75V; Reverse Recovery Time (trr): 4ns; Operating Junction Temperature Range: -65℃~+150℃@(Tj); Non-Repetitive Peak Forward Surge Current: 2A
KEY0-KEY3 = KH-6X6X6H-STM: Circuit:SPST Actuator Style:Round Button Mounting Type:Surface Mount,Vertical Length:6mm Width:6mm Switch Height:6mm with Bracket:Without Bracket Contact Current:50mA Voltage Rating:12V Actuator/Cap Color:Black Termination Style:Gull Wing Life:80,000 Cycl; LCSC Part Name: 6*6*6mm 立贴 轻触开关; Supplier Part: C2837532; Manufacturer: kinghelm(金航标); Supplier Footprint: SMD-4P,6x6mm; JLCPCB Part Class: Extended Part; Datasheet: https://item.szlcsc.com/datasheet/KH-6X6X6H-STM/3009602.html; Supplier: LCSC; Circuit: SPST; Actuator Style: Round Button; Mounting Type: Surface Mount,Vertical; Length: 6mm; Width: 6mm; Switch Height: 6mm; with Bracket: Without Bracket; Contact Current: 50mA; Voltage Rating: 12V; Actuator/Cap Color: Black; Termination Style: Gull Wing; Life: 80,000 Cycles
OSC1 = OT2EL4C4JI-111OLP-50M: Frequency:50MHz Normal temperature Frequency Tolerance:±10ppm Normal temperature Frequency Tolerance:±10ppm Output Type:CMOS Voltage - Supply:1.8V~3.3V Voltage - Supply:1.8V~3.3V Frequency Stability:±20ppm Frequency Stability:±20ppm Operating Temperature:; LCSC Part Name: YSO110TR 50MHZ 1.8V-3.3V ±10PPM -40~85℃ (±20PPM) CMOS; Supplier Part: C5203552; Manufacturer: YXC(扬兴晶振); Supplier Footprint: SMD3225-4P; JLCPCB Part Class: Extended Part; Datasheet: https://item.szlcsc.com/datasheet/OT2EL4C4JI-111OLP-50M/5892914.html; Supplier: LCSC; Normal temperature Frequency Tolerance: ±10ppm; Output Type: CMOS; Voltage - Supply: 1.8V~3.3V; Frequency Stability: ±20ppm; Operating Temperature: -40℃~+85℃
Q1 = MMBT3904LT1G: type:NPN Current - Collector(Ic):200mA Collector - Emitter Voltage VCEO:40V Pd - Power Dissipation:225mW DC Current Gain:40@0.1mA,1.0V DC Current Gain:40@0.1mA,1.0V Transition frequency(fT):300MHz Current - Collector Cutoff:50nA Vce Saturation(VCE(sat)):2; LCSC Part Name: NPN 电流:200mA 电压:40V; Supplier Part: C81464; Manufacturer: onsemi(安森美); Supplier Footprint: SOT-23; JLCPCB Part Class: Extended Part; Datasheet: https://item.szlcsc.com/datasheet/MMBT3904LT1G/82615.html; Supplier: LCSC; type: NPN; Current - Collector(Ic): 200mA; Collector - Emitter Voltage VCEO: 40V; Pd - Power Dissipation: 225mW; DC Current Gain: 40@0.1mA,1.0V; Transition frequency(fT): 300MHz; Current - Collector Cutoff: 50nA; Vce Saturation(VCE(sat)): 200mV; Operating Temperature: -55℃~+150℃
RN1-RN3 = 4D03WGJ0103T5E: Number of Resistors: Resistance:10kΩ Tolerance:±5% Tolerance:±5% Power(Watts): Temperature Coefficient:±200ppm/℃ Temperature Coefficient:±200ppm/℃ Number of Pins:; LCSC Part Name: 10kΩ ±5%; Supplier Part: C29718; Manufacturer: UNI-ROYAL(厚声); Supplier Footprint: 0603x4; JLCPCB Part Class: Basic Part; Datasheet: https://atta.szlcsc.com/upload/public/pdf/source/20191224/C474318_2527498AE30E813171187CCD28401A71.pdf; Supplier: LCSC; Tolerance: ±5%; Temperature Coefficient: ±200ppm/℃
SW0-SW9 = SS12F44G4: Circuit:SPDT Actuator Style:- Termination Style:PC Pin Length:12mm Width:4.5mm Switch Height:6mm Mounting Type:Through Hole Actuator Color:- Current Rating:300mA Voltage Rating:50V Life:5,000 cycles Operating Temperature:-10℃~+50℃ Operating Temperature:-1; Supplier Part: C2887261; Manufacturer: SHOU HAN(首韩); Supplier Footprint: 插件,12x4.5mm; JLCPCB Part Class: Extended Part; Datasheet: https://item.szlcsc.com/datasheet/SS12F44G4/3103829.html; Supplier: LCSC; Circuit: SPDT; Termination Style: PC Pin; Length: 12mm; Width: 4.5mm; Switch Height: 6mm; Mounting Type: Through Hole; Current Rating: 300mA; Voltage Rating: 50V; Life: 5,000 cycles; Operating Temperature: -10℃~+50℃
C1 = CL10B104KO8NNNC: Capacitance:100nF Tolerance:±10% Tolerance:±10% Voltage Rating:16V Temperature Coefficient:X7R; LCSC Part Name: 100nF ±10% 16V; Supplier Part: C66501; Manufacturer: SAMSUNG(三星); Supplier Footprint: 0603; JLCPCB Part Class: Extended Part; Datasheet: https://item.szlcsc.com/datasheet/CL10B104KO8NNNC/67585.html; Supplier: LCSC; Tolerance: ±10%; Voltage Rating: 16V; Temperature Coefficient: X7R
C2-C4 = CL31A226KOHNNNE: Capacitance:22uF Tolerance:±10% Tolerance:±10% Voltage Rating:16V Temperature Coefficient:X5R; LCSC Part Name: 22uF ±10% 16V; Supplier Part: C90146; Manufacturer: SAMSUNG(三星); Supplier Footprint: 1206; JLCPCB Part Class: Extended Part; Datasheet: https://item.szlcsc.com/datasheet/CL31A226KOHNNNE/91331.html; Supplier: LCSC; Tolerance: ±10%; Voltage Rating: 16V; Temperature Coefficient: X5R
D1 = SMF5.0A_C193402: Polarity:Unidirectional Reverse Stand-Off Voltage (Vrwm):5V Clamping Voltage:9.2V Peak Pulse Current (Ipp):21.7A@10/1000us Peak Pulse Power Dissipation (Ppp):200W@10/1000us Voltage - Breakdown:7V Reverse Leakage Current (Ir):400uA Number of Channels:- Ope; LCSC Part Name: 单向TVS 5V截止 峰值脉冲电流：21.7A@10/1000us; Supplier Part: C193402; Manufacturer: MDD(辰达半导体); Supplier Footprint: SOD-123FL; JLCPCB Part Class: Extended Part; Datasheet: https://item.szlcsc.com/datasheet/SMF5.0A/231120.html; Supplier: LCSC; Polarity: Unidirectional; Reverse Stand-Off Voltage (Vrwm): 5V; Clamping Voltage: 9.2V; Peak Pulse Current (Ipp): 21.7A@10/1000us; Peak Pulse Power Dissipation (Ppp): 200W@10/1000us; Voltage - Breakdown: 7V; Reverse Leakage Current (Ir): 400uA; Operating Temperature: -55℃~+150℃; Type: TVS
F1 = MF-MSMF050-2: Voltage - Max:15V Current - Max:100A Hold Current:500mA Trip Current:1A Resistance - Initial (Ri) (Min):150mΩ Resistance - Post Trip (R1) (Max):1Ω Time to Trip(Max):- Operating Temperature:-40℃~+85℃ Operating Temperature:-40℃~+85℃ Length:5.4mm Width:3.2mm; LCSC Part Name: 15V 500mA 1812自恢复; Supplier Part: C17313; Manufacturer: BOURNS; Supplier Footprint: 1812; JLCPCB Part Class: Extended Part; Datasheet: https://item.szlcsc.com/datasheet/MF-MSMF050-2/17998.html; Supplier: LCSC; Voltage - Max: 15V; Current - Max: 100A; Hold Current: 500mA; Trip Current: 1A; Resistance - Initial (Ri) (Min): 150mΩ; Resistance - Post Trip (R1) (Max): 1Ω; Operating Temperature: -40℃~+85℃; Length: 5.4mm; Width: 3.2mm
L2-L5 = BLM18AG601SN1D: Impedance @ Frequency:600Ω@100MHz Tolerance:±25% Tolerance:±25% DC Resistance(DCR):380mΩ Current Rating:500mA Number of Circuits:1 Operating Temperature:-55℃~+125℃ Operating Temperature:-55℃~+125℃; LCSC Part Name: 单路 0603磁珠 阻抗600Ω@100MHz; Supplier Part: C19330; Manufacturer: muRata(村田); Supplier Footprint: 0603; JLCPCB Part Class: Extended Part; Datasheet: https://item.szlcsc.com/datasheet/BLM18AG601SN1D/20038.html; Supplier: LCSC; Impedance @ Frequency: 600Ω@100MHz; Tolerance: ±25%; DC Resistance(DCR): 380mΩ; Current Rating: 500mA; Number of Circuits: 1; Operating Temperature: -55℃~+125℃
L6 = TNR4030S-3R9MTF: Inductance:3.9uH Tolerance:±20% Tolerance:±20% Current Rating:2.3A Current - Saturation(Isat):3.3A Type:Magnetic Shielded Inductor; LCSC Part Name: 3.9uH ±20% 3.3A 4x4x3mm; Supplier Part: C42380168; Manufacturer: APV(爱普微); Supplier Footprint: SMD,4x4mm; JLCPCB Part Class: Extended Part; Datasheet: https://item.szlcsc.com/datasheet/TNR4030S-3R9MTF/44290257.html; Supplier: LCSC; Tolerance: ±20%; Current Rating: 2.3A; Current - Saturation(Isat): 3.3A; Type: Magnetic Shielded Inductor
R1 R2 = RMC06035.1K1%N: Type:Thick Film Resistor Resistance:5.1kΩ Tolerance:±1% Tolerance:±1% Power(Watts):100mW Voltage-Supply(Max):50V Temperature Coefficient:±100ppm/℃ Temperature Coefficient:±100ppm/℃ Operating Temperature:-55℃~+155℃ Operating Temperature:-55℃~+155℃; LCSC Part Name: 厚膜电阻 5.1kΩ ±1% 100mW; Supplier Part: C269716; Manufacturer: Tyohm(幸亚电阻); Supplier Footprint: 0603; JLCPCB Part Class: Extended Part; Datasheet: https://item.szlcsc.com/datasheet/RMC06035.1K1%2525N/259156.html; Supplier: LCSC; Type: Thick Film Resistor; Tolerance: ±1%; Power(Watts): 100mW; Voltage-Supply(Max): 50V; Temperature Coefficient: ±100ppm/℃; Operating Temperature: -55℃~+155℃
SW10 = MK-12C02-G020: Circuit:SPDT Actuator Style:Rectangular Columnar Termination Style:- Length:6.6mm Width:1.4mm Switch Height:4.7mm Mounting Type:Surface Mount, Right Angle Actuator Color:Black Current Rating:1A Voltage Rating:6V Life:10,000 Cycles Operating Temperature:-2; LCSC Part Name: 微型拨动开关; Supplier Part: C963206; Manufacturer: G-Switch(品赞); Supplier Footprint: SMD,6.6x1.4mm; JLCPCB Part Class: Extended Part; Datasheet: https://item.szlcsc.com/datasheet/MK-12C02-G020/1046841.html; Supplier: LCSC; Circuit: SPDT; Actuator Style: Rectangular Columnar; Length: 6.6mm; Width: 1.4mm; Switch Height: 4.7mm; Mounting Type: Surface Mount, Right Angle; Actuator Color: Black; Current Rating: 1A; Voltage Rating: 6V; Life: 10,000 Cycles; Operating Temperature: -20℃~+70℃
U1 = USB-TYPE-C-009: Connector Type:Type-C Protocol Standard:- Gender:Female Mounting Type:Surface Mount, Right Angle Number of Contacts:6P Number of Ports:1 Current Rating-Power:5A Voltage Rating:5V Connect-Disconnect Life:10,000 cycles Length:6.8mm Operating Temperature:-25; LCSC Part Name: Type-C 母 卧贴; Supplier Part: C2927029; Manufacturer: DEALON(德艺隆); Supplier Footprint: SMD; JLCPCB Part Class: Extended Part; Datasheet: https://item.szlcsc.com/datasheet/USB-TYPE-C-009/3252498.html; Supplier: LCSC; Connector Type: Type-C; Gender: Female; Mounting Type: Surface Mount, Right Angle; Number of Contacts: 6P; Number of Ports: 1; Current Rating-Power: 5A; Voltage Rating: 5V; Connect-Disconnect Life: 10,000 cycles; Length: 6.8mm; Operating Temperature: -25℃~+85℃
U2 = AP63203WU-7: Function:Buck Voltage - Supply:3.8V~32V Voltage - Supply:3.8V~32V Output Voltage:3.3V Output Voltage:3.3V Output Current:2A Frequency - Switching:1.1MHz Frequency - Switching:1.1MHz Operating Temperature:-40℃~+85℃@(TA) Operating Temperature:-40℃~+85℃@(TA); LCSC Part Name: 3.8V至32V输入、2A低静态电流同步降压转换器，增强EMI抑制; Supplier Part: C780769; Manufacturer: DIODES(美台); Supplier Footprint: TSOT-23-6; JLCPCB Part Class: Extended Part; Datasheet: https://item.szlcsc.com/datasheet/AP63203WU-7/832852.html; Supplier: LCSC; Function: Buck; Voltage - Supply: 3.8V~32V; Output Voltage: 3.3V; Output Current: 2A; Frequency - Switching: 1.1MHz; Operating Temperature: -40℃~+85℃@(TA); Synchronous Rectifier: Yes; Number of Outputs: 1; Topology: Buck; Quiescent Current: 22uA; Switch tube (built-in/external): Built-In; Output Type: Fixed

## Nets
3.3V: BUZZER1.1(+) C3.2 C4.2 C17.2 C18.2 C19.2 C20.2 C21.2 C22.2 C23.2 C24.2 C25.2 C26.2 C27.2 C28.2 C29.2 C30.2 C31.2 C32.2 C33.2 C34.2 C35.2 C36.2 C37.2 C38.2 C39.2 C40.2 C41.2 D2.1(C) H1.1 H1.2 H1.5 H1.6 H1.13 H1.14 H1.37 H1.38 H2.4 H3.11 H3.12 H4.11 H4.12 L2.1 L3.1 L4.1 L5.1 L6.2 OSC1.1(Tri-state) OSC1.4(VDD) R4.2 R5.2 R6.2 R7.2 R20.2 R21.2 SW0.3 SW1.3 SW2.3 SW3.3 SW4.3 SW5.3 SW6.3 SW7.3 SW8.3 SW9.3 U2.1(FB) U3.1(VCC_ONE) U3.12(VCCIO1) U3.13(IO/JTAGEN) U3.22(VCCIO1) U3.29(VCCIO2) U3.36(VCC_ONE) U3.37(VCC_ONE) U3.43(VCCIO3) U3.56(VCCIO3) U3.58(VCC_ONE) U3.64(VCCIO3) U3.72(VCC_ONE) U3.73(VCC_ONE) U3.82(VCCIO5) U3.93(VCCIO6) U3.102(VCCIO6) U3.108(VCC_ONE) U3.109(VCC_ONE) U3.111(VCCIO8) U3.118(VCC_ONE) U3.120(IO/CONFIG_SEL) U3.121(VCCIO8) U3.122(Input_only/nCONFIG) U3.132(VCC_ONE) U3.136(VCCIO8) U3.142(VCC_ONE) U3.144(VCC_ONE)
3.3VA: C42.2 C43.2 C44.2 C45.2 C46.2 L2.2 L3.2 L4.2 L5.2 U3.2(VCCA4) U3.34(VCCA2) U3.35(VCCA1) U3.71(VCCA5) U3.107(VCCA3)
5VF: C2.2 F1.1 LED10.1(+) U2.2(EN) U2.3(VIN)
+5V: D1.1(C) F1.2 SW10.2
GND: C2.1 C3.1 C4.1 C17.1 C18.1 C19.1 C20.1 C21.1 C22.1 C23.1 C24.1 C25.1 C26.1 C27.1 C28.1 C29.1 C30.1 C31.1 C32.1 C33.1 C34.1 C35.1 C36.1 C37.1 C38.1 C39.1 C40.1 C41.1 C42.1 C43.1 C44.1 C45.1 C46.1 D1.2(A) H1.3 H1.4 H1.9 H1.10 H1.19 H1.20 H1.27 H1.28 H1.31 H1.32 H1.35 H1.36 H1.39 H1.40 H2.2 H2.10 H3.9 H3.10 H4.9 H4.10 HEX0.1(COM) HEX0.6(COM) HEX1.1(COM) HEX1.6(COM) HEX2.1(COM) HEX2.6(COM) HEX3.1(COM) HEX3.6(COM) KEY0.4(D) KEY1.4(D) KEY2.4(D) KEY3.4(D) OSC1.2(GND) Q1.2 R1.1 R2.1 R3.1 R8.1 R9.1 R10.1 R11.1 R13.1 R14.1 R15.1 R16.1 R17.1 R18.1 R19.2 SW0.1 SW1.1 SW2.1 SW3.1 SW4.1 SW5.1 SW6.1 SW7.1 SW8.1 SW9.1 U1.A12(GND) U1.B12(GND) U2.4(GND) U3.11(GND) U3.20(GND) U3.30(GND) U3.38(GND) U3.45(GND) U3.57(GND) U3.66(GND) U3.83(GND) U3.96(GND) U3.104(GND) U3.110(GND) U3.119(GND) U3.133(GND) U3.143(GND) U3.145(EP)
VCC: SW10.3 U1.A9(VBUS) U1.B9(VBUS)
BUZZ: R12.2 U3.100(IO/DIFFIO_RX_R18n/DIFFOUT_R18n)
CLK: R22.1 U3.28(IO/CLK1p/DIFFIO_RX_L16p/DIFFOUT_L16p)
HEX_0_A: RN11.8 U3.55(IO/VREFB3N0)
HEX_0_B: RN11.7 U3.54(IO/DIFFIO_TX_RX_B7p/DIFFOUT_B7p)
HEX_0_C: RN11.6 U3.53(IO/DIFFIO_RX_B8p/DIFFOUT_B8p)
HEX_0_D: RN10.8 U3.51(IO/DIFFIO_RX_B8n/DIFFOUT_B8n)
HEX_0_DP: RN11.5 U3.52(IO/DIFFIO_TX_RX_B7n/DIFFOUT_B7n)
HEX_0_E: RN10.7 U3.50(IO/DIFFIO_TX_RX_B5p/DIFFOUT_B5p)
HEX_0_F: RN10.5 U3.48(IO/DIFFIO_TX_RX_B5n/DIFFOUT_B5n)
HEX_0_G: RN10.6 U3.49(IO/DIFFIO_RX_B6p/DIFFOUT_B6p)
HEX_1_A: RN9.8 U3.47(IO/DIFFIO_RX_B6n/DIFFOUT_B6n)
HEX_1_B: RN9.7 U3.46(IO/DIFFIO_TX_RX_B3p/DIFFOUT_B3p)
HEX_1_C: RN9.6 U3.44(IO/DIFFIO_TX_RX_B3n/DIFFOUT_B3n)
HEX_1_D: RN8.8 U3.41(IO/DIFFIO_RX_B2p/DIFFOUT_B2p)
HEX_1_DP: RN9.5 U3.42(IO/DIFFIO_TX_RX_B1p/DIFFOUT_B1p)
HEX_1_E: RN8.7 U3.40(IO/DIFFIO_TX_RX_B1n/DIFFOUT_B1n)
HEX_1_F: RN8.5 U3.33(IO/PLL_L_CLKOUTp/DIFFIO_RX_L19p/DIFFOUT_L19p)
HEX_1_G: RN8.6 U3.39(IO/DIFFIO_RX_B2n/DIFFOUT_B2n)
HEX_2_A: RN7.8 U3.32(IO/PLL_L_CLKOUTn/DIFFIO_RX_L19n/DIFFOUT_L19n)
HEX_2_B: RN7.7 U3.31(IO/VREFB2N0)
HEX_2_C: RN7.6 U3.27(IO/CLK1n/DIFFIO_RX_L16n/DIFFOUT_L16n)
HEX_2_D: RN6.8 U3.25(IO/CLK0n/DIFFIO_RX_L14n/DIFFOUT_L14n)
HEX_2_DP: RN7.5 U3.26(IO/CLK0p/DIFFIO_RX_L14p/DIFFOUT_L14p)
HEX_2_E: RN6.7 U3.24(IO/DIFFIO_RX_L12p/DIFFOUT_L12p)
HEX_2_F: RN6.5 U3.21(IO/DIFFIO_RX_L10p/DIFFOUT_L10p)
HEX_2_G: RN6.6 U3.23(IO/DIFFIO_RX_L12n/DIFFOUT_L12n)
HEX_3_A: RN5.8 U3.10(IO/DIFFIO_RX_L3p/DIFFOUT_L3p)
HEX_3_B: RN5.7 U3.9(IO/DIFFIO_RX_L4p/DIFFOUT_L4p)
HEX_3_C: RN5.6 U3.8(IO/DIFFIO_RX_L3n/DIFFOUT_L3n)
HEX_3_D: RN4.8 U3.6(IO/DIFFIO_RX_L1p/DIFFOUT_L1p)
HEX_3_DP: RN5.5 U3.7(IO/DIFFIO_RX_L4n/DIFFOUT_L4n)
HEX_3_E: RN4.7 U3.5(IO/DIFFIO_RX_L2p/DIFFOUT_L2p)
HEX_3_F: RN4.5 U3.3(IO/DIFFIO_RX_L2n/DIFFOUT_L2n)
HEX_3_G: RN4.6 U3.4(IO/DIFFIO_RX_L1n/DIFFOUT_L1n)
KEY0: KEY0.2(B) R7.1 U3.77(IO)
KEY1: KEY1.2(B) R6.1 U3.76(IO/DIFFIO_RX_R2n/DIFFOUT_R2n)
KEY2: KEY2.2(B) R5.1 U3.75(IO/DIFFIO_RX_R1p/DIFFOUT_R1p)
KEY3: KEY3.2(B) R4.1 U3.74(IO/DIFFIO_RX_R2p/DIFFOUT_R2p)
LED0: LED0.1(+) U3.70(IO/DIFFIO_RX_B17p/DIFFOUT_B17p)
LED1: LED1.1(+) U3.69(IO/DIFFIO_TX_RX_B16p/DIFFOUT_B16p)
LED2: LED2.1(+) U3.68(IO/DIFFIO_RX_B17n/DIFFOUT_B17n)
LED3: LED3.1(+) U3.67(IO/DIFFIO_TX_RX_B16n/DIFFOUT_B16n)
LED4: LED4.1(+) U3.65(IO/DIFFIO_TX_RX_B14p/DIFFOUT_B14p)
LED5: LED5.1(+) U3.63(IO/DIFFIO_TX_RX_B14n/DIFFOUT_B14n)
LED6: LED6.1(+) U3.62(IO/DIFFIO_RX_B13p/DIFFOUT_B13p)
LED7: LED7.1(+) U3.61(IO/DIFFIO_TX_RX_B12p/DIFFOUT_B12p)
LED8: LED8.1(+) U3.60(IO/DIFFIO_RX_B13n/DIFFOUT_B13n)
LED9: LED9.1(+) U3.59(IO/DIFFIO_TX_RX_B12n/DIFFOUT_B12n)
P1_IO1: RN13.8 U3.115(IO/DEV_OE/DIFFIO_RX_T5p/DIFFOUT_T5p)
P1_IO2: RN13.7 U3.114(IO/VREFB8N0)
P1_IO3: RN13.6 U3.113(IO/DEV_CLRn/DIFFIO_RX_T3n/DIFFOUT_T3n)
P1_IO4: RN13.5 U3.112(IO/DIFFIO_RX_T3p/DIFFOUT_T3p)
P1_IO5: RN12.8 U3.106(IO/DIFFIO_RX_R23n/DIFFOUT_R23n)
P1_IO6: RN12.7 U3.105(IO/DIFFIO_RX_R23p/DIFFOUT_R23p)
P1_IO7: RN12.6 U3.103(IO/DIFFIO_RX_R21n/DIFFOUT_R21n)
P1_IO8: RN12.5 U3.101(IO/DIFFIO_RX_R21p/DIFFOUT_R21p)
P2_IO1: RN15.8 U3.99(IO/DIFFIO_RX_R17n/DIFFOUT_R17n)
P2_IO2: RN15.7 U3.98(IO/DIFFIO_RX_R18p/DIFFOUT_R18p)
P2_IO3: RN15.6 U3.97(IO/DIFFIO_RX_R17p/DIFFOUT_R17p)
P2_IO4: RN15.5 U3.95(IO/DPCLK2/DIFFIO_RX_R16n/DIFFOUT_R16n)
P2_IO5: RN14.8 U3.94(IO/DPCLK3/DIFFIO_RX_R16p/DIFFOUT_R16p)
P2_IO6: RN14.7 U3.92(IO/VREFB6N0)
P2_IO7: RN14.6 U3.91(IO/CLK3n/DIFFIO_RX_R12n/DIFFOUT_R12n)
P2_IO8: RN14.5 U3.90(IO/CLK3p/DIFFIO_RX_R12p/DIFFOUT_R12p)
PIN_0: H1.34 U3.116(IO)
PIN_1: H1.33 U3.117(IO/DIFFIO_RX_T5n/DIFFOUT_T5n)
PIN_2: H1.30 U3.123(IO/DIFFIO_RX_T8p/DIFFOUT_T8p)
PIN_3: H1.29 U3.124(IO/DIFFIO_RX_T7p/DIFFOUT_T7p)
PIN_4: H1.26 U3.125(IO/DIFFIO_RX_T8n/DIFFOUT_T8n)
PIN_5: H1.25 U3.126(IO/DIFFIO_RX_T7n/DIFFOUT_T7n)
PIN_6: H1.24 U3.127(IO/DIFFIO_RX_T10p/DIFFOUT_T10p)
PIN_7: H1.23 U3.128(IO/DIFFIO_RX_T9p/DIFFOUT_T9p)
PIN_8: H1.22 U3.129(IO/DIFFIO_RX_T10n/DIFFOUT_T10n)
PIN_9: H1.21 U3.130(IO/CRC_ERROR/DIFFIO_RX_T9n/DIFFOUT_T9n)
PIN_10: H1.18 U3.131(IO/nSTATUS/DIFFIO_RX_T11p/DIFFOUT_T11p)
PIN_11: H1.17 U3.134(IO/DIFFIO_RX_T12p/DIFFOUT_T12p)
PIN_12: H1.16 U3.135(IO/CONF_DONE/DIFFIO_RX_T11n/DIFFOUT_T11n)
PIN_13: H1.15 U3.137(IO/DIFFIO_RX_T12n/DIFFOUT_T12n)
PIN_14: H1.12 U3.138(IO/DIFFIO_RX_T13p/DIFFOUT_T13p)
PIN_15: H1.11 U3.139(IO/DIFFIO_RX_T14p/DIFFOUT_T14p)
PIN_16: H1.8 U3.140(IO/DIFFIO_RX_T13n/DIFFOUT_T13n)
PIN_17: H1.7 U3.141(IO/DIFFIO_RX_T14n/DIFFOUT_T14n)
SW0: RN1.8 U3.89(IO/CLK2n/DIFFIO_RX_R10n/DIFFOUT_R10n)
SW1: RN1.7 U3.88(IO/CLK2p/DIFFIO_RX_R10p/DIFFOUT_R10p)
SW2: RN1.6 U3.87(IO/DIFFIO_RX_R6n/DIFFOUT_R6n)
SW3: RN1.5 U3.86(IO/DIFFIO_RX_R7n/DIFFOUT_R7n)
SW4: RN2.8 U3.85(IO/DIFFIO_RX_R6p/DIFFOUT_R6p)
SW5: RN2.7 U3.84(IO/DIFFIO_RX_R7p/DIFFOUT_R7p)
SW6: RN2.6 U3.81(IO/DIFFIO_RX_R3n/DIFFOUT_R3n)
SW7: RN2.5 U3.80(IO/VREFB5N0)
SW8: RN3.8 U3.79(IO/DIFFIO_RX_R3p/DIFFOUT_R3p)
SW9: RN3.7 U3.78(IO/DIFFIO_RX_R1n/DIFFOUT_R1n)
TCK: H2.1 R19.1 U3.16(IO/TCK/DIFFIO_RX_L7p/DIFFOUT_L7p)
TDI: H2.9 R21.1 U3.17(IO/TDI/DIFFIO_RX_L8n/DIFFOUT_L8n)
TDO: H2.3 U3.18(IO/TDO/DIFFIO_RX_L8p/DIFFOUT_L8p)
TMS: H2.5 R20.1 U3.15(IO/TMS/DIFFIO_RX_L7n/DIFFOUT_L7n)
$2N232: R1.2 U1.A5(CC1)
$2N233: R2.2 U1.B5(CC2)
$2N467: LED10.2(-) R3.2
$2N798: C1.2 L6.1 U2.5(SW)
$2N800: C1.1 U2.6(BST)
$5N780: RN1.1 SW0.2
$5N782: RN2.4 SW7.2
$5N783: RN3.2 SW9.2
$5N784: RN3.1 SW8.2
$5N785: RN1.4 SW3.2
$5N786: RN2.1 SW4.2
$5N787: RN1.3 SW2.2
$5N788: RN1.2 SW1.2
$5N789: RN2.2 SW5.2
$5N790: RN2.3 SW6.2
$5N1435: Q1.1 R12.1
$5N1437: BUZZER1.2(-) D2.2(A) Q1.3
$5N1571: OSC1.3(OUT) R22.2
$6N1755: LED0.2(-) R8.2
$6N1756: LED1.2(-) R13.2
$6N1757: LED2.2(-) R9.2
$6N1758: LED4.2(-) R10.2
$6N1759: LED3.2(-) R14.2
$6N1760: LED5.2(-) R15.2
$6N1761: LED6.2(-) R11.2
$6N1762: LED7.2(-) R16.2
$6N1767: LED8.2(-) R17.2
$6N1768: LED9.2(-) R18.2
$6N4229: HEX1.7(DP) RN9.4
$6N4231: HEX1.10(A) RN9.1
$6N4232: HEX1.9(B) RN9.2
$6N4233: HEX1.8(C) RN9.3
$6N4234: HEX0.3(G) RN10.3
$6N4235: HEX0.2(F) RN10.4
$6N4236: HEX0.5(D) RN10.1
$6N4237: HEX0.4(E) RN10.2
$6N4238: HEX1.3(G) RN8.3
$6N4239: HEX1.2(F) RN8.4
$6N4241: HEX1.4(E) RN8.2
$6N4242: HEX1.5(D) RN8.1
$6N4277: HEX2.10(A) RN7.1
$6N4278: HEX2.9(B) RN7.2
$6N4279: HEX2.8(C) RN7.3
$6N4280: HEX2.7(DP) RN7.4
$6N4282: HEX0.7(DP) RN11.4
$6N4285: HEX0.10(A) RN11.1
$6N4286: HEX0.9(B) RN11.2
$6N4287: HEX0.8(C) RN11.3
$6N4310: HEX2.3(G) RN6.3
$6N4311: HEX2.2(F) RN6.4
$6N4312: HEX2.5(D) RN6.1
$6N4313: HEX2.4(E) RN6.2
$6N4315: HEX3.10(A) RN5.1
$6N4316: HEX3.9(B) RN5.2
$6N4317: HEX3.8(C) RN5.3
$6N4318: HEX3.7(DP) RN5.4
$6N4329: HEX3.4(E) RN4.2
$6N4330: HEX3.5(D) RN4.1
$6N4331: HEX3.3(G) RN4.3
$6N4332: HEX3.2(F) RN4.4
$7N869: H4.8 RN14.4
$7N870: H3.6 RN12.2
$7N871: H3.8 RN12.4
$7N872: H3.1 RN13.1
$7N933: H3.7 RN12.3
$7N934: H3.5 RN12.1
$7N935: H3.3 RN13.3
$7N985: H4.5 RN14.1
$7N986: H4.6 RN14.2
$7N987: H4.7 RN14.3
$7N989: H3.4 RN13.4
$7N990: H3.2 RN13.2
$7N1007: H4.3 RN15.3
$7N1008: H4.1 RN15.1
$7N1021: H4.4 RN15.4
$7N1023: H4.2 RN15.2

Not connected (* = marked no-connect by the designer): BUZZER1 3* 4*; H2 6* 7* 8*; KEY0 1(A) 3(C); KEY1 1(A) 3(C); KEY2 1(A) 3(C); KEY3 1(A) 3(C); RN3 3 4 5 6; SW0 4* 5*; SW1 4* 5*; SW2 4* 5*; SW3 4* 5*; SW4 4* 5*; SW5 4* 5*; SW6 4* 5*; SW7 4* 5*; SW8 4* 5*; SW9 4* 5*; SW10 1* 4* 5* 6* 7*; U1 7(EH)*; U3 14(IO/VREFB1N0) 19(IO/DIFFIO_RX_L10n/DIFFOUT_L10n)

## Notes on the sheets
sheet 1
- USB C
- POWER SWITCH
- 3.3V REGULATOR
sheet 2
- MAX 10 FPGA
sheet 3
- DECOUPLING
sheet 4
- BUTTONs
- SWITCH
- BUZZER
- OSCILATOR
sheet 5
- 7 SEG DISPLAY
- LEDs
sheet 6
- 2X40 HEADER
- JTAG
- PMOD
